# Altium project ImmPCB2.PRJPCB (part 1 of 2)
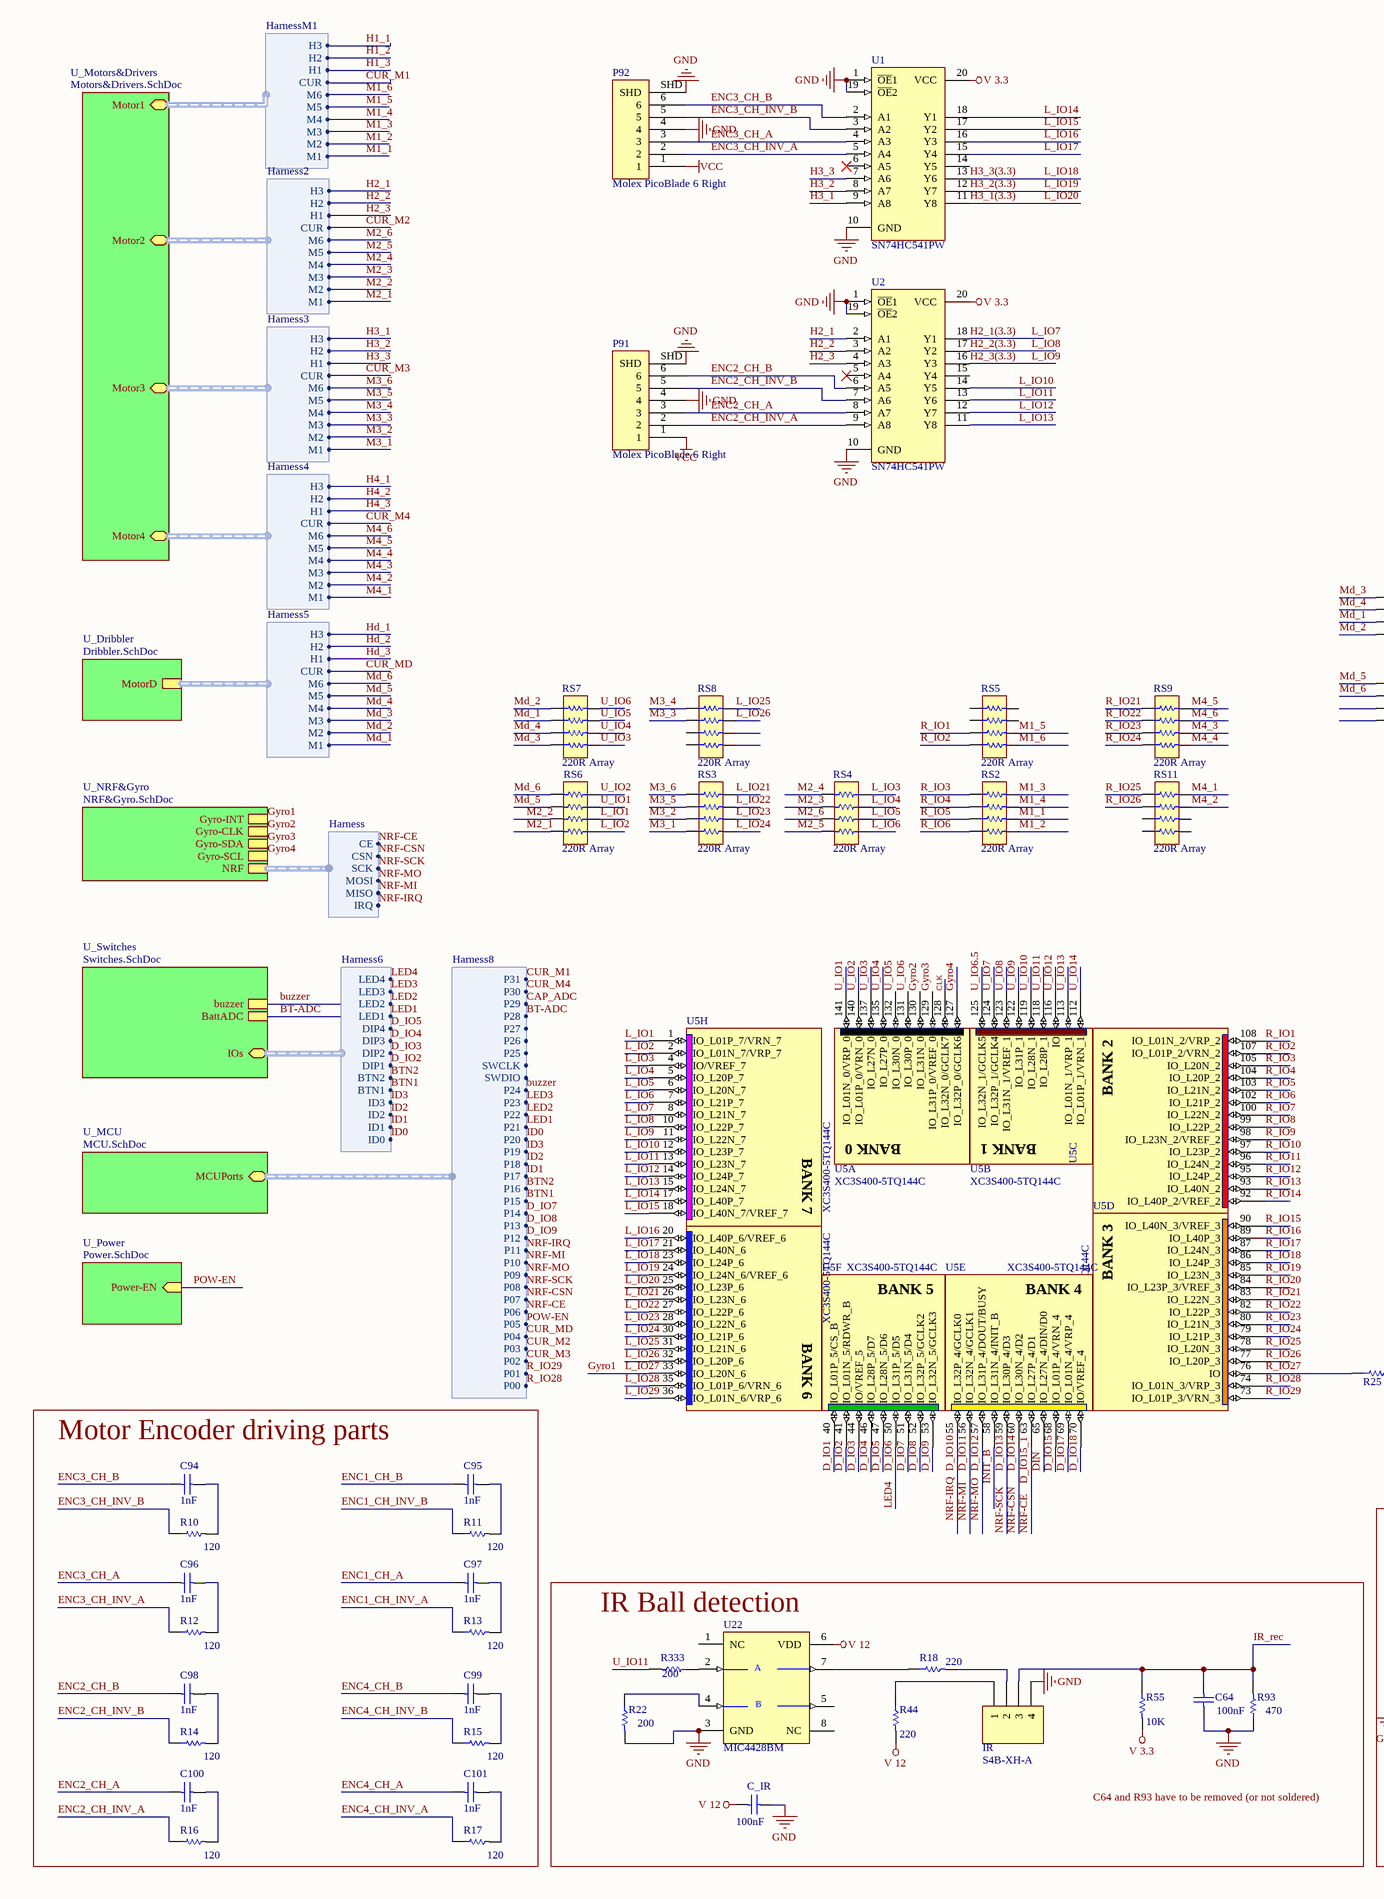
[diagram p0: FPGA.SchDoc, left]
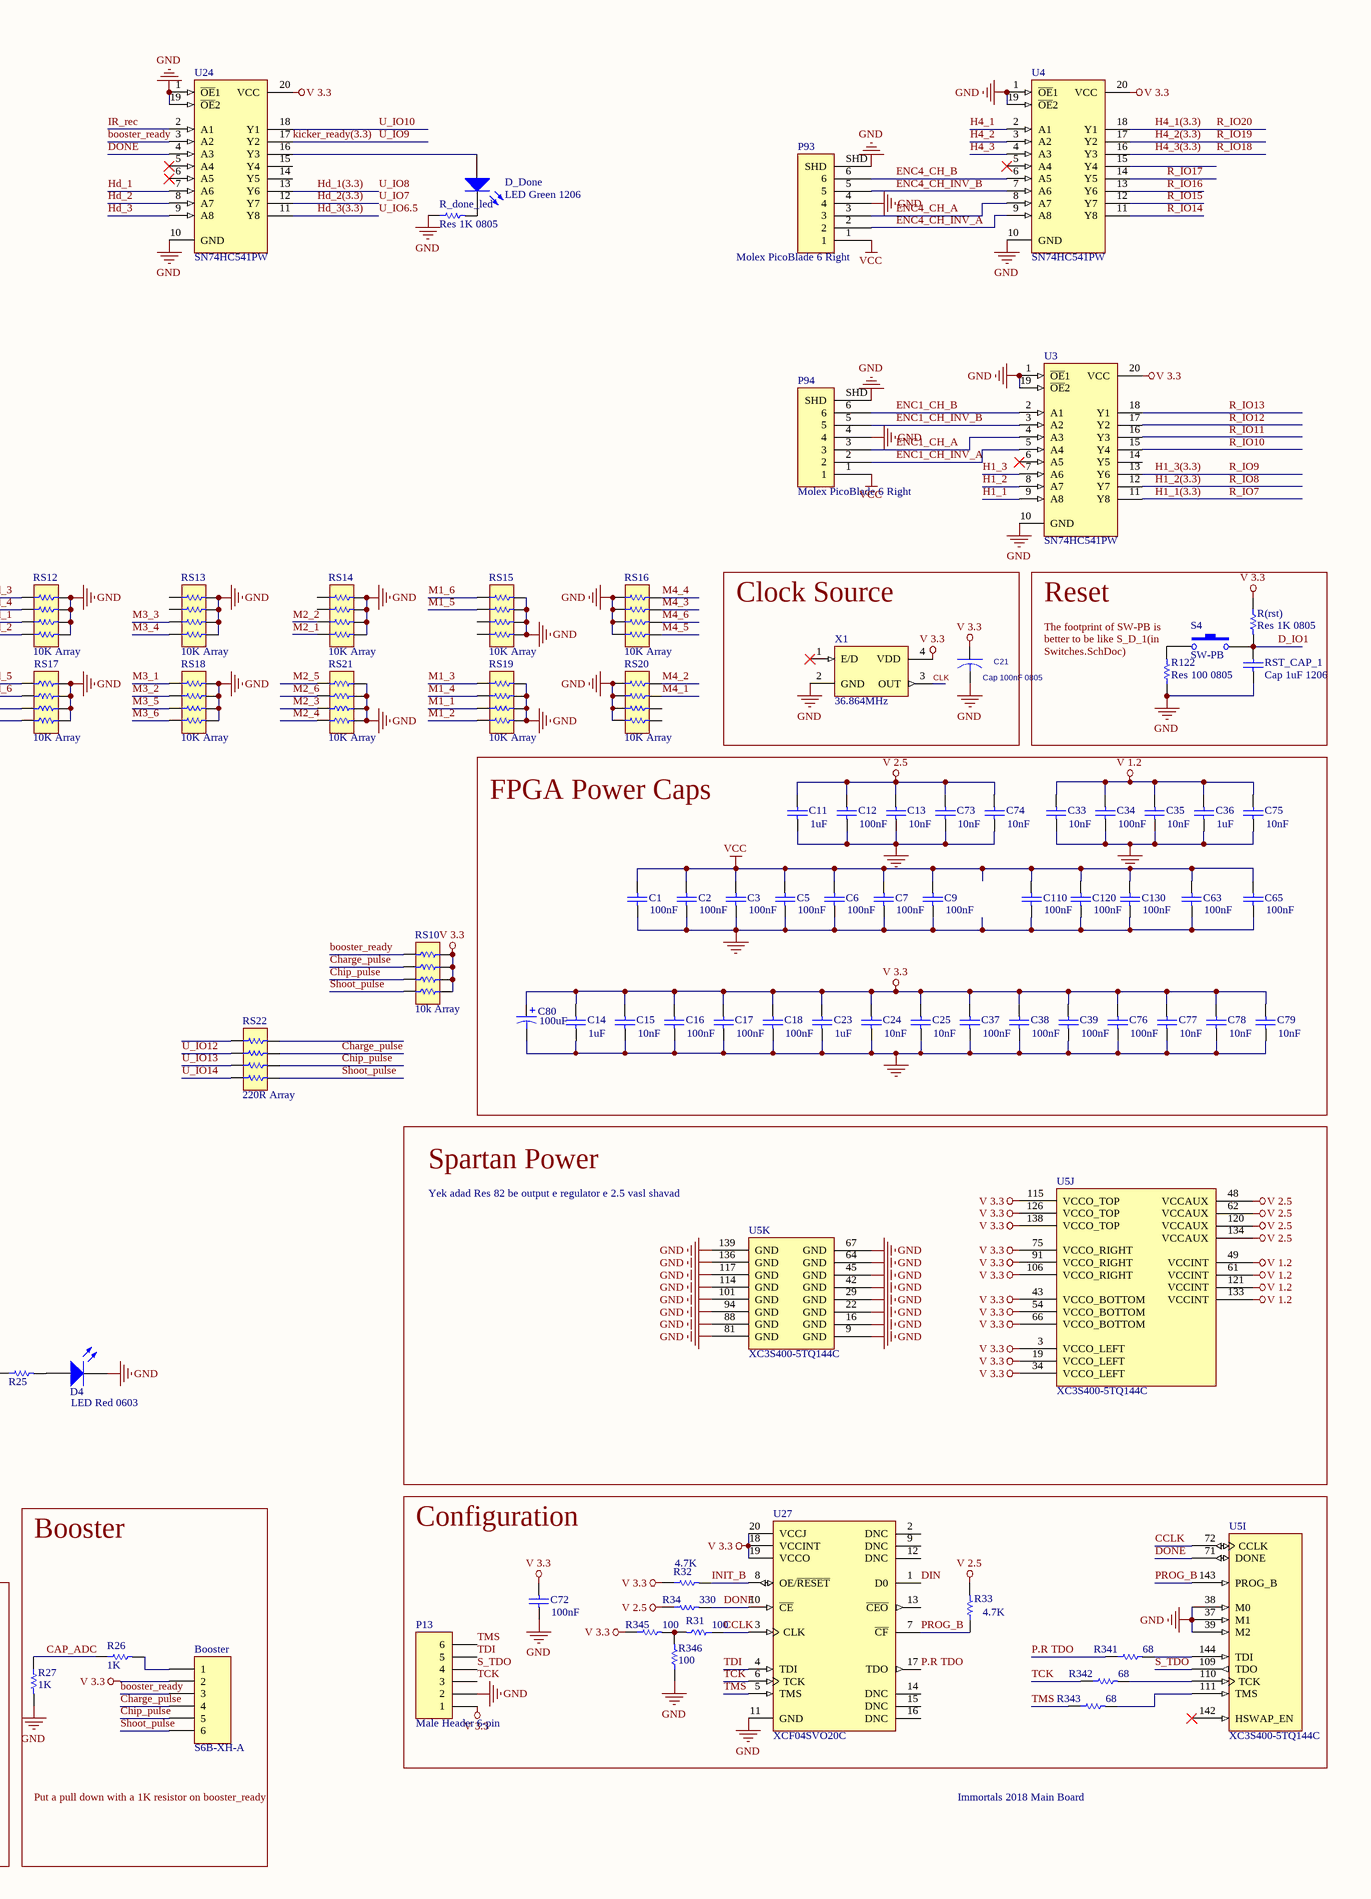
[diagram p1: FPGA.SchDoc, right]
7 sheets, 374 parts. Net scope: hierarchical (ports join the sheet entries above them; power ports are global).
Board file: ImmPCB2.PCBDOC
Sheets:
  FPGA.SchDoc
    U_Motors&Drivers = Motors&Drivers.SchDoc
    U_Dribbler = Dribbler.SchDoc
    U_Power = Power.SchDoc
    U_Switches = Switches.SchDoc
    U_NRF&Gyro = NRF&Gyro.SchDoc
    U_MCU = MCU.SchDoc

## Sheet FPGA.SchDoc
size A2

### Parts
Booster  S6B-XH-A  [S6B-XH-A]
C1  value 100nF  [C1206]  (hidden comment: Cap 100nF 1206)
C2  value 100nF  [C1206]  (hidden comment: Cap 100nF 1206)
C3  value 100nF  [C1206]  (hidden comment: Cap 100nF 1206)
C5  value 100nF  [C1206]  (hidden comment: Cap 100nF 1206)
C6  value 100nF  [C1206]  (hidden comment: Cap 100nF 1206)
C7  value 100nF  [C1206]  (hidden comment: Cap 100nF 1206)
C9  value 100nF  [C1206]  (hidden comment: Cap 100nF 1206)
C11  value 1uF  [1608[0603]]  (hidden comment: Cap 1uF 0603)
C12  value 100nF  [1608[0603]]  (hidden comment: Cap 100nF 0603)
C13  value 10nF  [1608[0603]]  (hidden comment: Cap 10nF 0603)
C14  value 1uF  [1608[0603]]  (hidden comment: Cap 1uF 0603)
C15  value 10nF  [1608[0603]]  (hidden comment: Cap 10nF 0603)
C16  value 100nF  [1608[0603]]  (hidden comment: Cap 100nF 0603)
C17  value 100nF  [1608[0603]]  (hidden comment: Cap 100nF 0603)
C18  value 100nF  [1608[0603]]  (hidden comment: Cap 100nF 0603)
C21  Cap 100nF 0805  [2012[0805]]
C23  value 1uF  [1608[0603]]  (hidden comment: Cap 1uF 0603)
C24  value 10nF  [1608[0603]]  (hidden comment: Cap 10nF 0603)
C25  value 10nF  [1608[0603]]  (hidden comment: Cap 10nF 0603)
C33  value 10nF  [1608[0603]]  (hidden comment: Cap 10nF 0603)
C34  value 100nF  [1608[0603]]  (hidden comment: Cap 100nF 0603)
C35  value 10nF  [1608[0603]]  (hidden comment: Cap 10nF 0603)
C36  value 1uF  [1608[0603]]  (hidden comment: Cap 1uF 0603)
C37  value 100nF  [1608[0603]]  (hidden comment: Cap 100nF 0603)
C38  value 100nF  [1608[0603]]  (hidden comment: Cap 100nF 0603)
C39  value 100nF  [1608[0603]]  (hidden comment: Cap 100nF 0603)
C63  value 100nF  [C0805]  (hidden comment: Cap 100nF 0805)
C64  value 100nF  [1608[0603]]  (hidden comment: Cap 100nF 0603)
C65  value 100nF  [C0805]  (hidden comment: Cap 100nF 0805)
C72  value 100nF  [C0805]  (hidden comment: Cap 100nF 0805)
C73  value 10nF  [1608[0603]]  (hidden comment: Cap 10nF 0603)
C74  value 10nF  [1608[0603]]  (hidden comment: Cap 10nF 0603)
C75  value 10nF  [1608[0603]]  (hidden comment: Cap 10nF 0603)
C76  value 100nF  [1608[0603]]  (hidden comment: Cap 100nF 0603)
C77  value 10nF  [1608[0603]]  (hidden comment: Cap 10nF 0603)
C78  value 10nF  [1608[0603]]  (hidden comment: Cap 10nF 0603)
C79  value 10nF  [1608[0603]]  (hidden comment: Cap 10nF 0603)
C80  value 100uF  [6332[2512]]  (hidden comment: Cap 100uF 2512)
C94  value 1nF  [1608[0603]]  (hidden comment: Cap 1nF 0603)
C95  value 1nF  [1608[0603]]  (hidden comment: Cap 1nF 0603)
C96  value 1nF  [1608[0603]]  (hidden comment: Cap 1nF 0603)
C97  value 1nF  [1608[0603]]  (hidden comment: Cap 1nF 0603)
C98  value 1nF  [1608[0603]]  (hidden comment: Cap 1nF 0603)
C99  value 1nF  [1608[0603]]  (hidden comment: Cap 1nF 0603)
C100  value 1nF  [1608[0603]]  (hidden comment: Cap 1nF 0603)
C101  value 1nF  [1608[0603]]  (hidden comment: Cap 1nF 0603)
C110  value 100nF  [C1206]  (hidden comment: Cap 100nF 1206)
C120  value 100nF  [C1206]  (hidden comment: Cap 100nF 1206)
C130  value 100nF  [C1206]  (hidden comment: Cap 100nF 1206)
C_IR  value 100nF  [C0805]  (hidden comment: Cap 100nF 0805)
D4  LED Red 0603  [LED 0603]
D_Done  LED Green 1206  [3.2X1.6X1.1 - GREEN]
IR  S4B-XH-A  [S4B-XH-A]
P13  Male Header 6-pin  [HDR1X6]
P91  Molex PicoBlade 6 Right  [Molex PicoBlade 6 Right SMD]
P92  Molex PicoBlade 6 Right  [Molex PicoBlade 6 Right SMD]
P93  Molex PicoBlade 6 Right  [Molex PicoBlade 6 Right SMD]
P94  Molex PicoBlade 6 Right  [Molex PicoBlade 6 Right SMD]
R10  value 120  [1608[0603]]  (hidden comment: Res 120 0603)
R11  value 120  [1608[0603]]  (hidden comment: Res 120 0603)
R12  value 120  [1608[0603]]  (hidden comment: Res 120 0603)
R13  value 120  [1608[0603]]  (hidden comment: Res 120 0603)
R14  value 120  [1608[0603]]  (hidden comment: Res 120 0603)
R15  value 120  [1608[0603]]  (hidden comment: Res 120 0603)
R16  value 120  [1608[0603]]  (hidden comment: Res 120 0603)
R17  value 120  [1608[0603]]  (hidden comment: Res 120 0603)
R18  value 220  [2012[0805]]  (hidden comment: Res 220 0805)
R22  value 200  [2012[0805]]  (hidden comment: Res 200 0805)
R25  Res 330 0603  [R0603]  (value not drawn)
R26  value 1K  [2012[0805]]  (hidden comment: Res 1K 0805)
R27  value 1K  [2012[0805]]  (hidden comment: Res 1K 0805)
R31  value 100  [2012[0805]]  (hidden comment: Res 100 0805)
R32  value 4.7K  [2012[0805]]  (hidden comment: Res 4.7K 0805)
R33  value 4.7K  [2012[0805]]  (hidden comment: Res 4.7K 0805)
R34  value 330  [2012[0805]]  (hidden comment: Res 330 0805)
R44  value 220  [2012[0805]]  (hidden comment: Res 220 0805)
R55  value 10K  [2012[0805]]  (hidden comment: Res 10K 0805)
R93  value 470  [1608[0603]]  (hidden comment: Res 470 0603)
R122  Res 100 0805  [2012[0805]]
R333  value 200  [2012[0805]]  (hidden comment: Res 200 0805)
R341  value 68  [2012[0805]]  (hidden comment: Res 68 0805)
R342  value 68  [2012[0805]]  (hidden comment: Res 68 0805)
R343  value 68  [2012[0805]]  (hidden comment: Res 68 0805)
R345  value 100  [2012[0805]]  (hidden comment: Res 100 0805)
R346  value 100  [2012[0805]]  (hidden comment: Res 100 0805)
R(rst)  Res 1K 0805  [2012[0805]]
R_done_led  Res 1K 0805  [2012[0805]]
RS2  220R Array  [RES-4B]
RS3  220R Array  [RES-4B]
RS4  220R Array  [RES-4B]
RS5  220R Array  [RES-4B]
RS6  220R Array  [RES-4B]
RS7  220R Array  [RES-4B]
RS8  220R Array  [RES-4B]
RS9  220R Array  [RES-4B]
RS10  10k Array  [RES-4B]
RS11  220R Array  [RES-4B]
RS12  10K Array  [RES-4B]
RS13  10K Array  [RES-4B]
RS14  10K Array  [RES-4B]
RS15  10K Array  [RES-4B]
RS16  10K Array  [RES-4B]
RS17  10K Array  [RES-4B]
RS18  10K Array  [RES-4B]
RS19  10K Array  [RES-4B]
RS20  10K Array  [RES-4B]
RS21  10K Array  [RES-4B]
RS22  220R Array  [RES-4B]
RST_CAP_1  Cap 1uF 1206  [3216[1206]]
S4  SW-PB  [SPST-2]
U1  SN74HC541PW  [PW020_N]
U2  SN74HC541PW  [PW020_N]
U3  SN74HC541PW  [PW020_N]
U4  SN74HC541PW  [PW020_N]
U5  XC3S400-5TQ144C  [TQ144_L]  (parts A,B,C,D,E,F,G,H,I,J,K of 11)
U22  MIC4428BM  [NSO8_L]
U24  SN74HC541PW  [PW020_N]
U27  XCF04SVO20C  [VO20_N]
X1  36.864MHz  [QSMO_4200]

### Blocks framed on the sheet
Clock Source: C21 X1
Reset: R122 R(rst) RST_CAP_1 S4
FPGA Power Caps: C1-C3 C5-C7 C9 C11-C18 C23-C25 C33-C39 C63 C65 C73-C80 C110 C120 C130
Spartan Power: U5
Motor Encoder driving parts: C94-C101 R10-R17
Booster: Booster R26 R27
Configuration: C72 P13 R31-R34 R341-R343 R345 R346 U5 U27
IR Ball detection: C64 C_IR IR R18 R22 R44 R55 R93 R333 U22

### Sub-sheets
U_Dribbler = Dribbler.SchDoc: MotorD (harness Harness5)
U_MCU = MCU.SchDoc: MCUPorts (harness Harness8)
U_Motors&Drivers = Motors&Drivers.SchDoc: Motor1 (harness HarnessM1), Motor2 (harness Harness2), Motor4 (harness Harness4), Motor3 (harness Harness3)
U_NRF&Gyro = NRF&Gyro.SchDoc: NRF (harness Harness), Gyro-SCL, Gyro-SDA, Gyro-CLK, Gyro-INT
U_Power = Power.SchDoc: Power-EN (in)
U_Switches = Switches.SchDoc: BattADC, buzzer, IOs (harness Harness6)

### Harnesses
HarnessM1: M1, M2, M3, M4, M5, M6, CUR, H1, H2, H3
Harness2: M1, M2, M3, M4, M5, M6, CUR, H1, H2, H3
Harness3: M1, M2, M3, M4, M5, M6, CUR, H1, H2, H3
Harness4: M1, M2, M3, M4, M5, M6, CUR, H1, H2, H3
Harness5: M1, M2, M3, M4, M5, M6, CUR, H1, H2, H3
Harness6: ID0, ID1, ID2, ID3, BTN1, BTN2, DIP1, DIP2, DIP3, DIP4, LED1, LED2, LED3, LED4
Harness: IRQ, MISO, MOSI, SCK, CSN, CE
Harness8: P00, P01, P02, P03, P04, P05, P06, P07, P08, P09, P10, P11, P12, P13, P14, P15, P16, P17, P18, P19, P20, P21, P22, P23, P24, SWDIO, SWCLK, P25, P26, P27, P28, P29, P30, P31

### Nets
GND: C1.2 C2.2 C3.2 C5.2 C6.2 C7.2 C9.2 C11.1 C12.1 C13.1 C14.1 C15.1 C16.1 C17.1 C18.1 C21.2 C23.1 C24.1 C25.1 C33.1 C34.1 C35.1 C36.1 C37.1 C38.1 C39.1 C63.2 C64.1 C65.2 C72.2 C73.1 C74.1 C75.1 C76.1 C77.1 C78.1 C79.1 C80.2 C110.2 C120.2 C130.2 C_IR.2 D4.2(K) IR.4 P13.2 P91.4 P91.SHD P92.4 P92.SHD P93.4 P93.SHD P94.4 P94.SHD R22.2 R27.2 R93.1 R122.1 R346.1 R_done_led.1 RS12.2 RS12.4 RS12.6 RS12.8 RS13.2 RS13.4 RS13.6 RS13.8 RS14.2 RS14.4 RS14.6 RS14.8 RS15.2 RS15.4 RS15.6 RS15.8 RS16.1 RS16.3 RS16.5 RS16.7 RS17.1 RS17.3 RS17.5 RS17.7 RS18.2 RS18.4 RS18.6 RS18.8 RS19.2 RS19.4 RS19.6 RS19.8 RS20.1 RS20.3 RS20.5 RS20.7 RS21.1 RS21.3 RS21.5 RS21.7 RST_CAP_1.1 U1.1(~{OE}1) U1.10(GND) U1.19(~{OE}2) U2.1(~{OE}1) U2.10(GND) U2.19(~{OE}2) U3.1(~{OE}1) U3.10(GND) U3.19(~{OE}2) U4.1(~{OE}1) U4.10(GND) U4.19(~{OE}2) U5.9(GND) U5.16(GND) U5.22(GND) U5.29(GND) U5.37(M1) U5.38(M0) U5.39(M2) U5.42(GND) U5.45(GND) U5.64(GND) U5.67(GND) U5.81(GND) U5.88(GND) U5.94(GND) U5.101(GND) U5.114(GND) U5.117(GND) U5.136(GND) U5.139(GND) U22.3(GND) U24.1(~{OE}1) U24.10(GND) U24.19(~{OE}2) U27.11(GND) X1.2(GND)
V 1.2: C33.2 C34.2 C35.2 C36.2 C75.2 U5.49(VCCINT) U5.61(VCCINT) U5.121(VCCINT) U5.133(VCCINT)
V 2.5: C11.2 C12.2 C13.2 C73.2 C74.2 R33.2 R34.1 U5.48(VCCAUX) U5.62(VCCAUX) U5.120(VCCAUX) U5.134(VCCAUX)
V 3.3: Booster.2 C14.2 C15.2 C16.2 C17.2 C18.2 C21.1 C23.2 C24.2 C25.2 C37.2 C38.2 C39.2 C72.1 C76.2 C77.2 C78.2 C79.2 C80.1 P13.1 R32.1 R55.2 R345.1 R(rst).1 RS10.1 RS10.3 RS10.5 RS10.7 U1.20(VCC) U2.20(VCC) U3.20(VCC) U4.20(VCC) U5.3(VCCO_LEFT) U5.19(VCCO_LEFT) U5.34(VCCO_LEFT) U5.43(VCCO_BOTTOM) U5.54(VCCO_BOTTOM) U5.66(VCCO_BOTTOM) U5.75(VCCO_RIGHT) U5.91(VCCO_RIGHT) U5.106(VCCO_RIGHT) U5.115(VCCO_TOP) U5.126(VCCO_TOP) U5.138(VCCO_TOP) U24.20(VCC) U27.18(VCCINT) U27.19(VCCO) U27.20(VCCJ) X1.4(VDD)
V 12: C_IR.1 R44.2 U22.6(VDD)
VCC: C1.1 C2.1 C3.1 C5.1 C6.1 C7.1 C9.1 C63.1 C65.1 C110.1 C120.1 C130.1 P91.1 P92.1 P93.1 P94.1
booster_ready: Booster.3 RS10.8 U24.3(A2)
BT-ADC: sheet U_Switches/BattADC, sheet U_MCU/MCUPorts.P28
BTN1: sheet U_Switches/IOs.BTN1, sheet U_MCU/MCUPorts.P15
BTN2: sheet U_Switches/IOs.BTN2, sheet U_MCU/MCUPorts.P16
buzzer: sheet U_Switches/buzzer, sheet U_MCU/MCUPorts.P24
CAP_ADC: R26.1 R27.1 ; sheet U_MCU/MCUPorts.P29
CCLK: R31.1 U5.72(CCLK) U27.3(CLK)
Charge_pulse: Booster.4 RS10.6 RS22.4
Chip_pulse: Booster.5 RS10.4 RS22.6
CLK: U5.128(IO_L32N_0/GCLK7) X1.3(OUT)
CUR_M1: sheet U_Motors&Drivers/Motor1.CUR, sheet U_MCU/MCUPorts.P31
CUR_M2: sheet U_Motors&Drivers/Motor2.CUR, sheet U_MCU/MCUPorts.P03
CUR_M3: sheet U_Motors&Drivers/Motor3.CUR, sheet U_MCU/MCUPorts.P02
CUR_M4: sheet U_Motors&Drivers/Motor4.CUR, sheet U_MCU/MCUPorts.P30
CUR_MD: sheet U_Dribbler/MotorD.CUR, sheet U_MCU/MCUPorts.P04
D_IO1: R(rst).2 RST_CAP_1.2 S4.2 U5.40(IO_L01P_5/CS_B)
D_IO2: U5.41(IO_L01N_5/RDWR_B) ; sheet U_Switches/IOs.DIP1
D_IO3: U5.44(IO/VREF_5) ; sheet U_Switches/IOs.DIP2
D_IO4: U5.46(IO_L28P_5/D7) ; sheet U_Switches/IOs.DIP3
D_IO5: U5.47(IO_L28N_5/D6) ; sheet U_Switches/IOs.DIP4
D_IO6: U5.50(IO_L31P_5/D5) ; sheet U_Switches/IOs.LED4  [also labelled LED4]
D_IO7: U5.51(IO_L31N_5/D4) ; sheet U_MCU/MCUPorts.P14
D_IO8: U5.52(IO_L32P_5/GCLK2) ; sheet U_MCU/MCUPorts.P13
D_IO9: U5.53(IO_L32N_5/GCLK3) ; sheet U_MCU/MCUPorts.P12
D_IO10: U5.55(IO_L32P_4/GCLK0) ; sheet U_NRF&Gyro/NRF.IRQ, sheet U_MCU/MCUPorts.P11  [also labelled NRF-IRQ]
D_IO11: U5.56(IO_L32N_4/GCLK1) ; sheet U_NRF&Gyro/NRF.MISO, sheet U_MCU/MCUPorts.P10  [also labelled NRF-MI]
D_IO12: U5.57(IO_L31P_4/DOUT/BUSY) ; sheet U_NRF&Gyro/NRF.MOSI, sheet U_MCU/MCUPorts.P09  [also labelled NRF-MO]
D_IO13: U5.59(IO_L30P_4/D3) ; sheet U_NRF&Gyro/NRF.SCK, sheet U_MCU/MCUPorts.P08  [also labelled NRF-SCK]
D_IO14: U5.60(IO_L30N_4/D2) ; sheet U_NRF&Gyro/NRF.CSN, sheet U_MCU/MCUPorts.P07  [also labelled NRF-CSN]
D_IO15: U5.68(IO_L01P_4/VRN_4)
D_IO15_1: U5.63(IO_L27P_4/D1) ; sheet U_NRF&Gyro/NRF.CE, sheet U_MCU/MCUPorts.P06  [also labelled NRF-CE]
D_IO17: U5.69(IO_L01N_4/VRP_4)
D_IO18: U5.70(IO/VREF_4)
DIN: U5.65(IO_L27N_4/DIN/D0) U27.1(D0)
DONE: R34.2 U5.71(DONE) U24.4(A3) U27.10(~{CE})
ENC1_CH_A: C97.2 P94.3 U3.4(A3)
ENC1_CH_B: C95.2 P94.6 U3.2(A1)
ENC1_CH_INV_A: P94.2 R13.1 U3.5(A4)
ENC1_CH_INV_B: P94.5 R11.1 U3.3(A2)
ENC2_CH_A: C100.2 P91.3 U2.8(A7)
ENC2_CH_B: C98.2 P91.6 U2.6(A5)
ENC2_CH_INV_A: P91.2 R16.1 U2.9(A8)
ENC2_CH_INV_B: P91.5 R14.1 U2.7(A6)
ENC3_CH_A: C96.2 P92.3 U1.4(A3)
ENC3_CH_B: C94.2 P92.6 U1.2(A1)
ENC3_CH_INV_A: P92.2 R12.1 U1.5(A4)
ENC3_CH_INV_B: P92.5 R10.1 U1.3(A2)
ENC4_CH_A: C101.2 P93.3 U4.8(A7)
ENC4_CH_B: C99.2 P93.6 U4.6(A5)
ENC4_CH_INV_A: P93.2 R17.1 U4.9(A8)
ENC4_CH_INV_B: P93.5 R15.1 U4.7(A6)
Gyro1: U5.33(IO_L20N_6) ; sheet U_NRF&Gyro/Gyro-INT  [also labelled L_IO27]
Gyro2: U5.130(IO_L31N_0) ; sheet U_NRF&Gyro/Gyro-CLK
Gyro3: U5.129(IO_L31P_0/VREF_0) ; sheet U_NRF&Gyro/Gyro-SDA
Gyro4: U5.127(IO_L32P_0/GCLK6) ; sheet U_NRF&Gyro/Gyro-SCL
H1_1: U3.9(A8) ; sheet U_Motors&Drivers/Motor1.H3
H1_1(3.3): U3.11(Y8) U5.100(IO_L22N_2)  [also labelled R_IO7]
H1_2: U3.8(A7) ; sheet U_Motors&Drivers/Motor1.H2
H1_2(3.3): U3.12(Y7) U5.99(IO_L22P_2)  [also labelled R_IO8]
H1_3: U3.7(A6) ; sheet U_Motors&Drivers/Motor1.H1
H1_3(3.3): U3.13(Y6) U5.98(IO_L23N_2/VREF_2)  [also labelled R_IO9]
H2_1: U2.2(A1) ; sheet U_Motors&Drivers/Motor2.H3
H2_1(3.3): U2.18(Y1) U5.8(IO_L21N_7)  [also labelled L_IO7]
H2_2: U2.3(A2) ; sheet U_Motors&Drivers/Motor2.H2
H2_2(3.3): U2.17(Y2) U5.10(IO_L22P_7)  [also labelled L_IO8]
H2_3: U2.4(A3) ; sheet U_Motors&Drivers/Motor2.H1
H2_3(3.3): U2.16(Y3) U5.11(IO_L22N_7)  [also labelled L_IO9]
H3_1: U1.9(A8) ; sheet U_Motors&Drivers/Motor3.H3
H3_1(3.3): U1.11(Y8) U5.25(IO_L23P_6)  [also labelled L_IO20]
H3_2: U1.8(A7) ; sheet U_Motors&Drivers/Motor3.H2
H3_2(3.3): U1.12(Y7) U5.24(IO_L24N_6/VREF_6)  [also labelled L_IO19]
H3_3: U1.7(A6) ; sheet U_Motors&Drivers/Motor3.H1
H3_3(3.3): U1.13(Y6) U5.23(IO_L24P_6)  [also labelled L_IO18]
H4_1: U4.2(A1) ; sheet U_Motors&Drivers/Motor4.H3
H4_1(3.3): U4.18(Y1) U5.84(IO_L23P_3/VREF_3)  [also labelled R_IO20]
H4_2: U4.3(A2) ; sheet U_Motors&Drivers/Motor4.H2
H4_2(3.3): U4.17(Y2) U5.85(IO_L23N_3)  [also labelled R_IO19]
H4_3: U4.4(A3) ; sheet U_Motors&Drivers/Motor4.H1
H4_3(3.3): U4.16(Y3) U5.86(IO_L24P_3)  [also labelled R_IO18]
Hd_1: U24.7(A6) ; sheet U_Dribbler/MotorD.H3
Hd_1(3.3): U5.123(IO_L31N_1/VREF_1) U24.13(Y6)  [also labelled U_IO8]
Hd_2: U24.8(A7) ; sheet U_Dribbler/MotorD.H2
Hd_2(3.3): U5.124(IO_L32P_1/GCLK4) U24.12(Y7)  [also labelled U_IO7]
Hd_3: U24.9(A8) ; sheet U_Dribbler/MotorD.H1
Hd_3(3.3): U5.125(IO_L32N_1/GCLK5) U24.11(Y8)  [also labelled U_IO6.5]
ID0: sheet U_Switches/IOs.ID0, sheet U_MCU/MCUPorts.P20
ID1: sheet U_Switches/IOs.ID1, sheet U_MCU/MCUPorts.P17
ID2: sheet U_Switches/IOs.ID2, sheet U_MCU/MCUPorts.P18
ID3: sheet U_Switches/IOs.ID3, sheet U_MCU/MCUPorts.P19
INIT_B: R32.2 U5.58(IO_L31N_4/INIT_B) U27.8(OE/~{RESET})
IR_rec: C64.2 IR.3 R55.1 R93.2 U24.2(A1)
kicker_ready(3.3): U5.122(IO_L31P_1) U24.17(Y2)  [also labelled U_IO9]
L_IO1: RS6.3 U5.1(IO_L01P_7/VRN_7)
L_IO2: RS6.1 U5.2(IO_L01N_7/VRP_7)
L_IO3: RS4.7 U5.4(IO/VREF_7)
L_IO4: RS4.5 U5.5(IO_L20P_7)
L_IO5: RS4.3 U5.6(IO_L20N_7)
L_IO6: RS4.1 U5.7(IO_L21P_7)
L_IO10: U2.14(Y5) U5.12(IO_L23P_7)
L_IO11: U2.13(Y6) U5.13(IO_L23N_7)
L_IO12: U2.12(Y7) U5.14(IO_L24P_7)
L_IO13: U2.11(Y8) U5.15(IO_L24N_7)
L_IO14: U1.18(Y1) U5.17(IO_L40P_7)
L_IO15: U1.17(Y2) U5.18(IO_L40N_7/VREF_7)
L_IO16: U1.16(Y3) U5.20(IO_L40P_6/VREF_6)
L_IO17: U1.15(Y4) U5.21(IO_L40N_6)
L_IO21: RS3.2 U5.26(IO_L23N_6)
L_IO22: RS3.4 U5.27(IO_L22P_6)
L_IO23: RS3.6 U5.28(IO_L22N_6)
L_IO24: RS3.8 U5.30(IO_L21P_6)
L_IO25: RS8.2 U5.31(IO_L21N_6)
L_IO26: RS8.4 U5.32(IO_L20P_6)
L_IO28: U5.35(IO_L01P_6/VRN_6)
L_IO29: U5.36(IO_L01N_6/VRP_6)
LED1: sheet U_Switches/IOs.LED1, sheet U_MCU/MCUPorts.P21
LED2: sheet U_Switches/IOs.LED2, sheet U_MCU/MCUPorts.P22
LED3: sheet U_Switches/IOs.LED3, sheet U_MCU/MCUPorts.P23
M1_1: RS2.6 RS19.5 ; sheet U_Motors&Drivers/Motor1.M1
M1_2: RS2.8 RS19.7 ; sheet U_Motors&Drivers/Motor1.M2
M1_3: RS2.2 RS19.1 ; sheet U_Motors&Drivers/Motor1.M3
M1_4: RS2.4 RS19.3 ; sheet U_Motors&Drivers/Motor1.M4
M1_5: RS5.6 RS15.3 ; sheet U_Motors&Drivers/Motor1.M5
M1_6: RS5.8 RS15.1 ; sheet U_Motors&Drivers/Motor1.M6
M2_1: RS6.2 RS14.7 ; sheet U_Motors&Drivers/Motor2.M1
M2_2: RS6.4 RS14.5 ; sheet U_Motors&Drivers/Motor2.M2
M2_3: RS4.6 RS21.4 ; sheet U_Motors&Drivers/Motor2.M3
M2_4: RS4.8 RS21.2 ; sheet U_Motors&Drivers/Motor2.M4
M2_5: RS4.2 RS21.8 ; sheet U_Motors&Drivers/Motor2.M5
M2_6: RS4.4 RS21.6 ; sheet U_Motors&Drivers/Motor2.M6
M3_1: RS3.7 RS18.1 ; sheet U_Motors&Drivers/Motor3.M1
M3_2: RS3.5 RS18.3 ; sheet U_Motors&Drivers/Motor3.M2
M3_3: RS8.3 RS13.5 ; sheet U_Motors&Drivers/Motor3.M3
M3_4: RS8.1 RS13.7 ; sheet U_Motors&Drivers/Motor3.M4
M3_5: RS3.3 RS18.5 ; sheet U_Motors&Drivers/Motor3.M5
M3_6: RS3.1 RS18.7 ; sheet U_Motors&Drivers/Motor3.M6
M4_1: RS11.2 RS20.4 ; sheet U_Motors&Drivers/Motor4.M1
M4_2: RS11.4 RS20.2 ; sheet U_Motors&Drivers/Motor4.M2
M4_3: RS9.6 RS16.4 ; sheet U_Motors&Drivers/Motor4.M3
M4_4: RS9.8 RS16.2 ; sheet U_Motors&Drivers/Motor4.M4
M4_5: RS9.2 RS16.8 ; sheet U_Motors&Drivers/Motor4.M5
M4_6: RS9.4 RS16.6 ; sheet U_Motors&Drivers/Motor4.M6
Md_1: RS7.3 RS12.5 ; sheet U_Dribbler/MotorD.M1
Md_2: RS7.1 RS12.7 ; sheet U_Dribbler/MotorD.M2
Md_3: RS7.7 RS12.1 ; sheet U_Dribbler/MotorD.M3
Md_4: RS7.5 RS12.3 ; sheet U_Dribbler/MotorD.M4
Md_5: RS6.6 RS17.8 ; sheet U_Dribbler/MotorD.M5
Md_6: RS6.8 RS17.6 ; sheet U_Dribbler/MotorD.M6
P.R TDO: R341.1 U27.17(TDO)
POW-EN: sheet U_Power/Power-EN, sheet U_MCU/MCUPorts.P05  [project net P0.05/AIN3]
PROG_B: R33.1 U5.143(PROG_B) U27.7(~{CF})
R_IO1: RS5.5 U5.108(IO_L01N_2/VRP_2)
R_IO2: RS5.7 U5.107(IO_L01P_2/VRN_2)
R_IO3: RS2.1 U5.105(IO_L20N_2)
R_IO4: RS2.3 U5.104(IO_L20P_2)
R_IO5: RS2.5 U5.103(IO_L21N_2)
R_IO6: RS2.7 U5.102(IO_L21P_2)
R_IO10: U3.15(Y4) U5.97(IO_L23P_2)
R_IO11: U3.16(Y3) U5.96(IO_L24N_2)
R_IO12: U3.17(Y2) U5.95(IO_L24P_2)
R_IO13: U3.18(Y1) U5.93(IO_L40N_2)
R_IO14: U4.11(Y8) U5.92(IO_L40P_2/VREF_2)
R_IO15: U4.12(Y7) U5.90(IO_L40N_3/VREF_3)
R_IO16: U4.13(Y6) U5.89(IO_L40P_3)
R_IO17: U4.14(Y5) U5.87(IO_L24N_3)
R_IO21: RS9.1 U5.83(IO_L22N_3)
R_IO22: RS9.3 U5.82(IO_L22P_3)
R_IO23: RS9.5 U5.80(IO_L21N_3)
R_IO24: RS9.7 U5.79(IO_L21P_3)
R_IO25: RS11.1 U5.78(IO_L20N_3)
R_IO26: RS11.3 U5.77(IO_L20P_3)
R_IO27: R25.1 U5.76(IO)
R_IO28: U5.74(IO_L01N_3/VRP_3) ; sheet U_MCU/MCUPorts.P00  [project net P0.00/XL1]
R_IO29: U5.73(IO_L01P_3/VRN_3) ; sheet U_MCU/MCUPorts.P01  [project net P0.01/XL2]
S_TDO: P13.4 U5.109(TDO)
Shoot_pulse: Booster.6 RS10.2 RS22.8
TCK: P13.3 R342.1 U27.6(TCK)
TDI: P13.5 U27.4(TDI)
TMS: P13.6 R343.1 U27.5(TMS)
U_IO1: RS6.5 U5.141(IO_L01N_0/VRP_0)
U_IO2: RS6.7 U5.140(IO_L01P_0/VRN_0)
U_IO3: RS7.8 U5.137(IO_L27N_0)
U_IO4: RS7.6 U5.135(IO_L27P_0)
U_IO5: RS7.4 U5.132(IO_L30N_0)
U_IO6: RS7.2 U5.131(IO_L30P_0)
U_IO10: U5.119(IO_L28N_1) U24.18(Y1)
U_IO11: R333.2 U5.118(IO_L28P_1)
U_IO12: RS22.3 U5.116(IO)
U_IO13: RS22.5 U5.113(IO_L01N_1/VRP_1)
U_IO14: RS22.7 U5.112(IO_L01P_1/VRN_1)
NetBooster_1: Booster.1 R26.2
NetC94_1: C94.1 R10.2
NetC95_1: C95.1 R11.2
NetC96_1: C96.1 R12.2
NetC97_1: C97.1 R13.2
NetC98_1: C98.1 R14.2
NetC99_1: C99.1 R15.2
NetC100_1: C100.1 R16.2
NetC101_1: C101.1 R17.2
NetD4_1: D4.1(A) R25.2
NetD_Done_1: D_Done.1(A) U24.16(Y3)
NetD_Done_2: D_Done.2(K) R_done_led.2
NetIR_1: IR.1 R44.1
NetIR_2: IR.2 R18.2
NetR18_1: R18.1 U22.7(OUTA)
NetR22_1: R22.1 U22.4(INB)
NetR31_2: R31.2 R345.2 R346.2
NetR122_2: R122.2 S4.1
NetR333_1: R333.1 U22.2(INA)
NetR341_2: R341.2 U5.144(TDI)
NetR342_2: R342.2 U5.110(TCK)
NetR343_2: R343.2 U5.111(TMS)

Not connected (* = marked no-connect by the designer): RS5 1 2 3 4; RS8 5 6 7 8; RS11 5 6 7 8; RS13 1 3; RS14 1 3; RS15 5 7; RS17 2 4; RS20 6 8; RS22 1 2; U1 6(A5)* 14(Y5); U2 5(A4)* 15(Y4); U3 6(A5)* 14(Y5); U4 5(A4)* 15(Y4); U5 142(HSWAP_EN)*; U22 1(NC) 5(OUTB) 8(NC); U24 5(A4)* 6(A5)* 14(Y5) 15(Y4); U27 2(DNC) 9(DNC) 12(DNC) 13(~{CEO}) 14(DNC) 15(DNC) 16(DNC); X1 1(E/D)*

### Notes on the sheet
- The footprint of SW-PB is
- (near S4) better to be like S_D_1(in
- (near R122) Switches.SchDoc)
- Yek adad Res 82 be output e regulator e 2.5 vasl shavad
- C64 and R93 have to be removed (or not soldered)
- Put a pull down with a 1K resistor on booster_ready
- Immortals 2018 Main Board
- (in symbol MAX4427CSA) A; B
- (in symbol XC3S400-5TQ144C, part A) BANK 0
- (in symbol XC3S400-5TQ144C, part B) BANK 1
- (in symbol XC3S400-5TQ144C, part C) BANK 2
- (in symbol XC3S400-5TQ144C, part D) BANK 3
- (in symbol XC3S400-5TQ144C, part E) BANK 4
- (in symbol XC3S400-5TQ144C, part F) BANK 5
- (in symbol XC3S400-5TQ144C, part G) BANK 6
- (in symbol XC3S400-5TQ144C, part H) BANK 7

### Library data of the parts
Booster P13 = Header 6: Header, 6-Pin; LatestRevisionDate: 17-Jul-2002; LatestRevisionNote: Re-released for DXP Platform.; Publisher: Altium Limited
C1-C3 C5-C7 C9 C63 C65 C72 C110 C120 C130 C_IR = CAP: Capacitor; Fitted: True
C11-C18 C23-C25 C33-C39 C64 C73-C79 C94-C101 = Cap Semi: Capacitor (Semiconductor SIM Model); Published: 8-Jun-2000; LatestRevisionDate: 17-Jul-2002; LatestRevisionNote: Re-released for DXP Platform.; PackageReference: C1206; Publisher: Altium Limited
C21 = C_Dup1: Value: Cap 100nF 0805
C80 = Cap Pol3: Polarized Capacitor (Surface Mount); Published: 8-Jun-2000; LatestRevisionDate: 17-Jul-2002; LatestRevisionNote: Re-released for DXP Platform.; PackageReference: C0805; Publisher: Altium Limited
D4 = LED 0603: LED ,SMD ,0603; Published: 8-Jun-2000; LatestRevisionDate: 17-Jul-2002; LatestRevisionNote: Re-released for DXP Platform.; PackageVersion: Feb-2002; PackageReference: 3.2X1.6X1.1; Publisher: Altium Limited; Value: LED Red 0603
D_Done = LED2: Typical RED, GREEN, YELLOW, AMBER GaAs LED; Published: 8-Jun-2000; LatestRevisionDate: 17-Jul-2002; LatestRevisionNote: Re-released for DXP Platform.; PackageDocument: Feb-2002; PackageReference: 3.2X1.6X1.1; Publisher: Altium Limited; Value: LED Green 1206
IR = Header 4: Header, 4-Pin; LatestRevisionDate: 17-Jul-2002; LatestRevisionNote: Re-released for DXP Platform.; Publisher: Altium Limited; Value: S4B-XH-A
R10-R18 R22 R26 R27 R31-R34 R44 R55 R93 R333 R341-R343 R345 R346 R_done_led = Res Semi: Semiconductor Resistor; Published: 8-Jun-2000; LatestRevisionDate: 17-Jul-2002; LatestRevisionNote: Re-released for DXP Platform.; PackageReference: AXIAL-0.5; Publisher: Altium Limited
  R_done_led: Value: 1K
R25 = R0603: Res 0603; Part Field 1: 3144; Value: 330
R122 R(rst) = Res1: Resistor; Published: 8-Jun-2000; LatestRevisionDate: 17-Jul-2002; LatestRevisionNote: Re-released for DXP Platform.; PackageReference: AXIAL-0.3; Publisher: Altium Limited
  R122: Value: Res 100 0805
  R(rst): Value: Res 1K 0805
RS2-RS22 = Resister Array: Resistor Array ,SMD
RST_CAP_1 = Cap: Capacitor; Published: 8-Jun-2000; LatestRevisionDate: 17-Jul-2002; LatestRevisionNote: Re-released for DXP Platform.; PackageReference: RAD-0.3; Publisher: Altium Limited; Value: Cap 1uF 1206
S4 = SW-PB: Switch; Value: Mini push button; Published: 24-Mar-1999; LatestRevisionDate: 17-Jul-2002; LatestRevisionNote: Re-released for DXP Platform.; PackageReference: SPST-2; Publisher: Altium Limited
U1-U4 U24 = SN74HC541PW: Octal Buffer/Driver with 3-State Outputs; Published: 8-Jun-2000; LatestRevisionDate: 13-Apr-2006; LatestRevisionNote: IPC-7351 Footprint Added.; DatasheetVersion: May-1997; PackageVersion: Mar-2000; PackageReference: DW020; Publisher: Altium Limited; PackageDescription: 20-Pin Plastic Small Outline Integrated Circuit 1.27 mm Pitch; Code_JEDEC: MS-013; Code_IPC: SOIC127P1030-20; ComponentLink1Description: Manufacturer Link; ComponentLink1URL: http://www.ti.com/; ComponentLink2Description: Datasheet; ComponentLink2URL: http://www-s.ti.com/sc/ds/sn74hc541.pdf
U5 = XC3S400-5TQ144C: Spartan-3 1.2V FPGA, 97 User I/Os, 144-Pin TQFP, High Performance, Commercial Grade; Ordering Information: Additional code may have to be appended for different mask revision devices.; Published: 17-Sep-2003; LatestRevisionDate: 13-Apr-2006; LatestRevisionNote: IPC-7351 Footprint Added.; DatasheetVersion: ver2.3, Nov-2007; PackageVersion: ver1.2, Jun-2004; PackageReference: TQ144; Publisher: Altium Limited; PackageDescription: 144-Pin Thin Quad Flat Pack (TQ144); Code_JEDEC: MS-026-BFB; ComponentLink1Description: Manufacturer Link; ComponentLink1URL: http://www.xilinx.com/products/silicon_solutions/fpgas/spartan_series/spartan3_fpgas/index.htm; ComponentLink2Description: Datasheet; ComponentLink2URL: http://direct.xilinx.com/bvdocs/publications/ds099.pdf
U22 = MAX4427CSA: Dual High-Speed 1.5A MOSFET Driver; Published: 16-Jan-2001; LatestRevisionDate: 13-Apr-2006; LatestRevisionNote: IPC-7351 Footprint Added.; DatasheetVersion: Mar-1993; PackageReference: NSO8; Publisher: Altium Limited; PackageDescription: 8-Pin Small Outline Integrated Circuit 1.27 mm Pitch; Code_JEDEC: MS-012-AA; Code_IPC: SOIC127P600-8; ComponentLink1Description: Manufacturer Link; ComponentLink1URL: http://www.maxim-ic.com/; ComponentLink2Description: Datasheet; ComponentLink2URL: http://pdfserv.maxim-ic.com/en/ds/MAX4426-MAX4428.pdf
U27 = XCF04SVO20C: XCF00S Series, Platform Flash In-System Programmable Configuration 3.3V PROM, 20-Pin TSOP, 4-Megabit, Commercial Grade; Published: 17-Sep-2003; LatestRevisionDate: 04-Mar-2005; LatestRevisionNote: Stylized 3D Model Added.; DatasheetVersion: ver2.9, May-2006; PackageVersion: ver1.2.1, Apr-2005; PackageReference: VO20; Publisher: Altium Limited; PackageDescription: 20-Pin Thin Shrink Small Outline Package (VO20); Code_JEDEC: MO-153-AC; ComponentLink1Description: Manufacturer Link; ComponentLink1URL: http://www.xilinx.com/products/design_resources/config_sol/index.htm; ComponentLink2Description: Datasheet; ComponentLink2URL: http://direct.xilinx.com/bvdocs/publications/ds123.pdf
X1 = QSMO_4200: QSMO - 4200 SERIES, 40MHz, SURFACE MOUNT CRYSTAL OSCILLATOR; Published: 5-Jan-2004; DatasheetDocument: 15-Jul-02; Publisher: Altium Limited

## Sheet Motors&Drivers.SchDoc
size A3
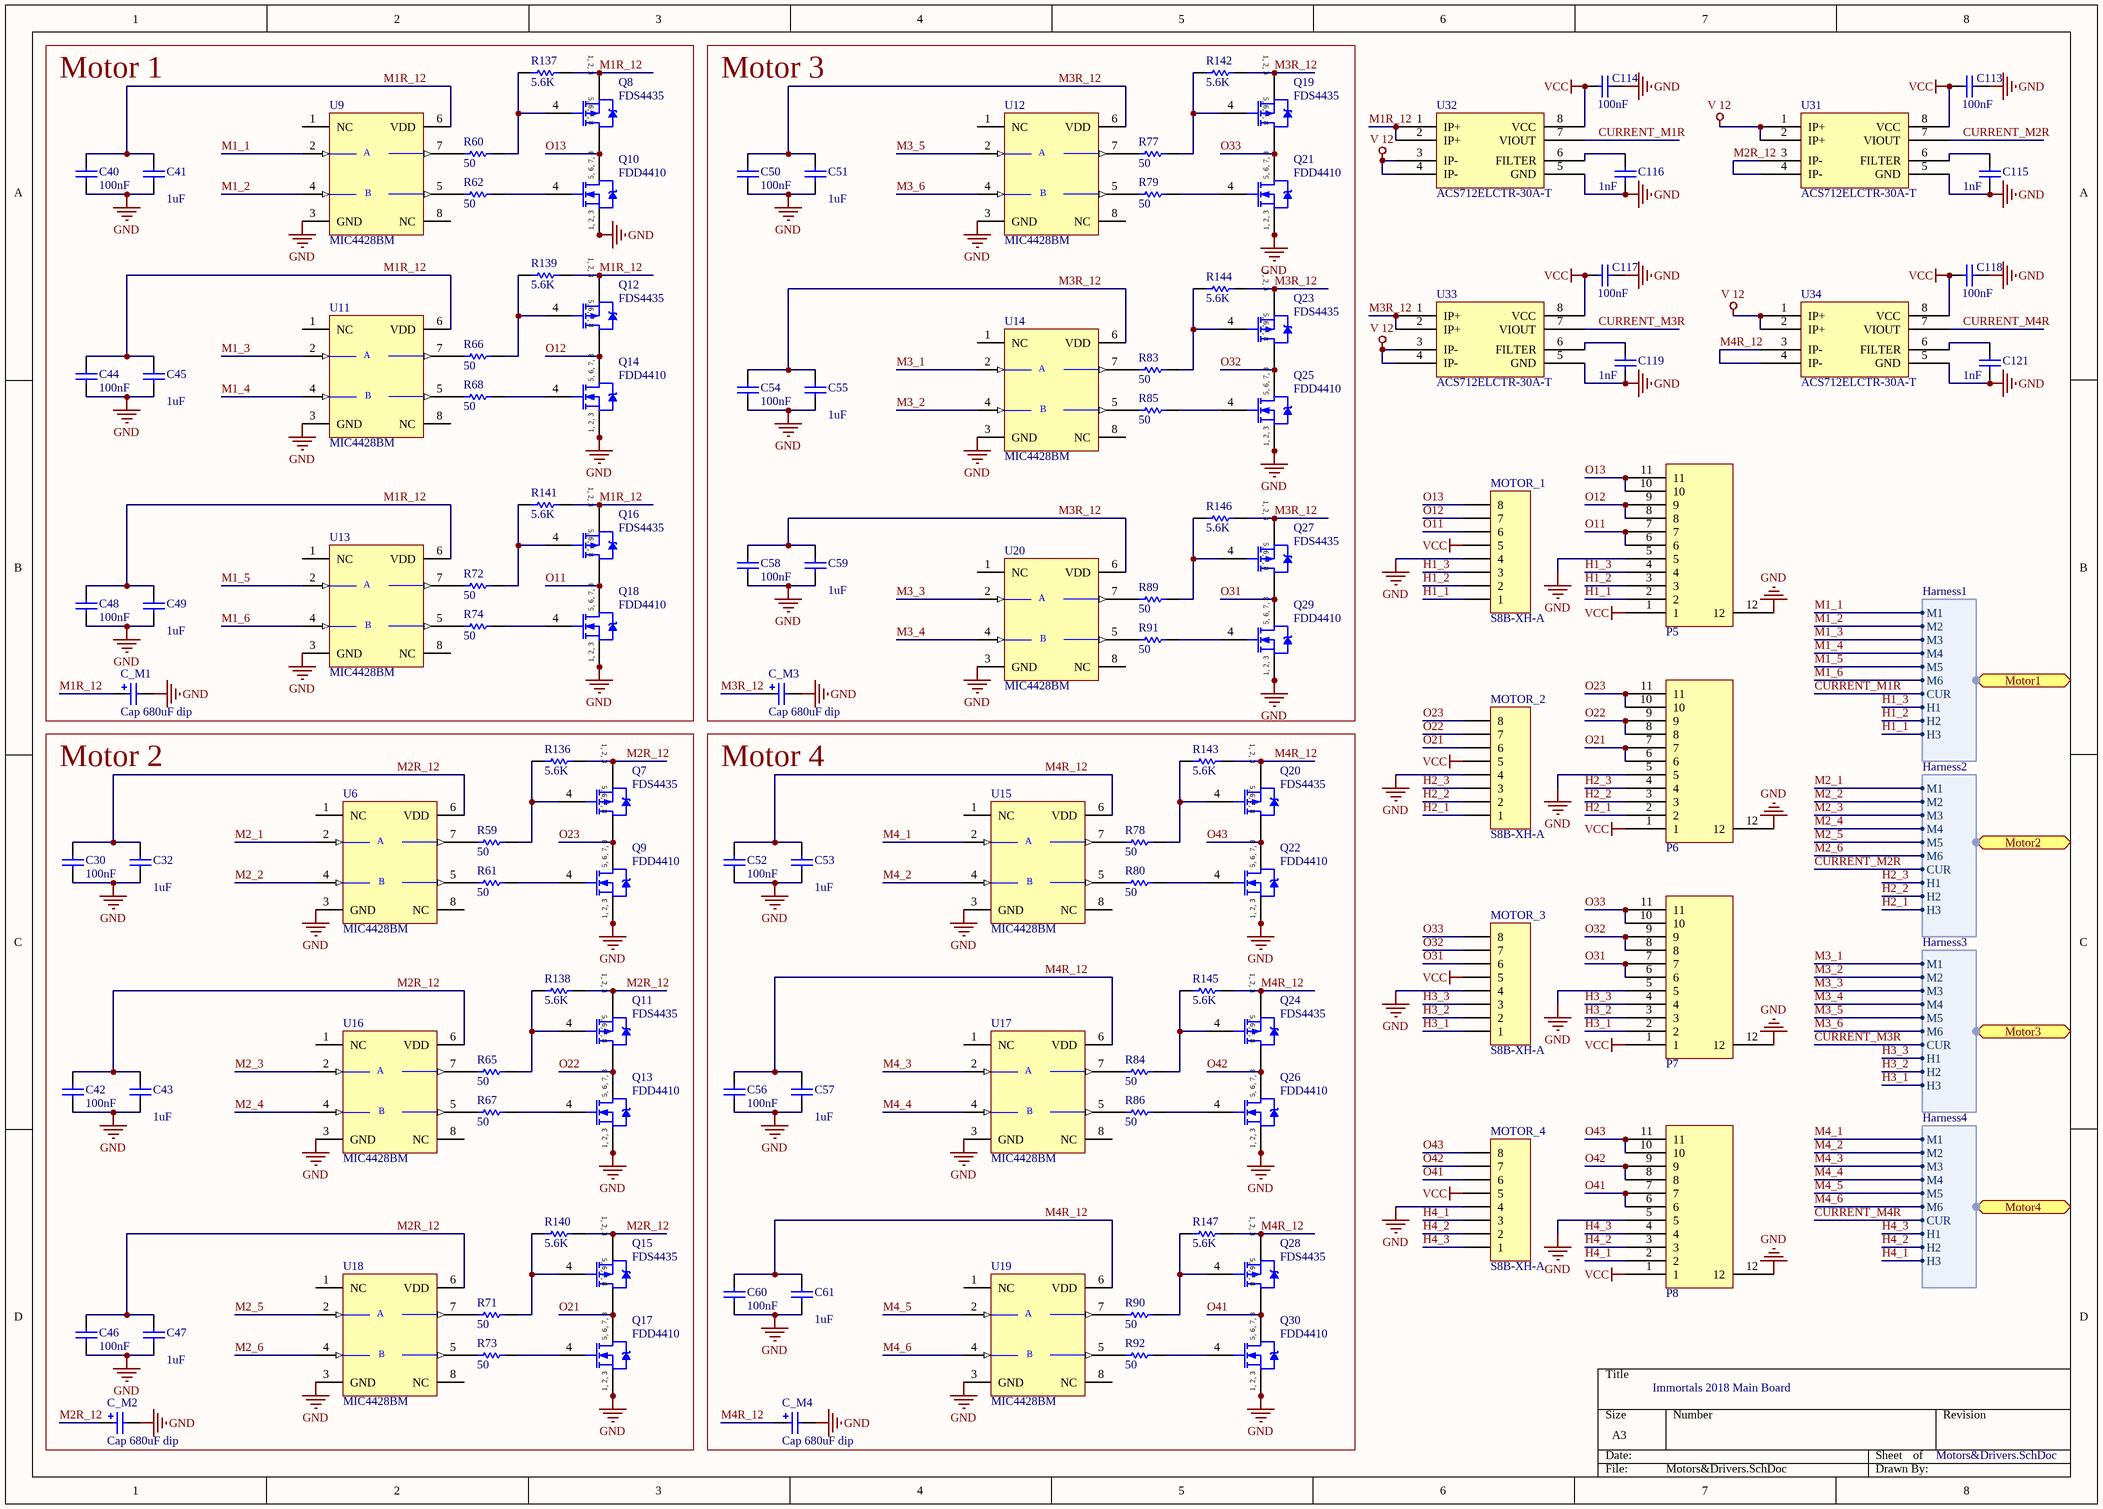
[diagram p2: Motors&Drivers.SchDoc]

### Parts
C30  value 100nF  [1608[0603]]  (hidden comment: Cap 100nF 0603)
C32  value 1uF  [1608[0603]]  (hidden comment: Cap 1uF 0603)
C40  value 100nF  [1608[0603]]  (hidden comment: Cap 100nF 0603)
C41  value 1uF  [1608[0603]]  (hidden comment: Cap 1uF 0603)
C42  value 100nF  [1608[0603]]  (hidden comment: Cap 100nF 0603)
C43  value 1uF  [1608[0603]]  (hidden comment: Cap 1uF 0603)
C44  value 100nF  [1608[0603]]  (hidden comment: Cap 100nF 0603)
C45  value 1uF  [1608[0603]]  (hidden comment: Cap 1uF 0603)
C46  value 100nF  [1608[0603]]  (hidden comment: Cap 100nF 0603)
C47  value 1uF  [1608[0603]]  (hidden comment: Cap 1uF 0603)
C48  value 100nF  [1608[0603]]  (hidden comment: Cap 100nF 0603)
C49  value 1uF  [1608[0603]]  (hidden comment: Cap 1uF 0603)
C50  value 100nF  [1608[0603]]  (hidden comment: Cap 100nF 0603)
C51  value 1uF  [1608[0603]]  (hidden comment: Cap 1uF 0603)
C52  value 100nF  [1608[0603]]  (hidden comment: Cap 100nF 0603)
C53  value 1uF  [1608[0603]]  (hidden comment: Cap 1uF 0603)
C54  value 100nF  [1608[0603]]  (hidden comment: Cap 100nF 0603)
C55  value 1uF  [1608[0603]]  (hidden comment: Cap 1uF 0603)
C56  value 100nF  [1608[0603]]  (hidden comment: Cap 100nF 0603)
C57  value 1uF  [1608[0603]]  (hidden comment: Cap 1uF 0603)
C58  value 100nF  [1608[0603]]  (hidden comment: Cap 100nF 0603)
C59  value 1uF  [1608[0603]]  (hidden comment: Cap 1uF 0603)
C60  value 100nF  [1608[0603]]  (hidden comment: Cap 100nF 0603)
C61  value 1uF  [1608[0603]]  (hidden comment: Cap 1uF 0603)
C113  value 100nF  [1608[0603]]  (hidden comment: Cap 100nF 0603)
C114  value 100nF  [1608[0603]]  (hidden comment: Cap 100nF 0603)
C115  value 1nF  [1608[0603]]  (hidden comment: Cap 1nF 0603)
C116  value 1nF  [1608[0603]]  (hidden comment: Cap 1nF 0603)
C117  value 100nF  [1608[0603]]  (hidden comment: Cap 100nF 0603)
C118  value 100nF  [1608[0603]]  (hidden comment: Cap 100nF 0603)
C119  value 1nF  [1608[0603]]  (hidden comment: Cap 1nF 0603)
C121  value 1nF  [1608[0603]]  (hidden comment: Cap 1nF 0603)
C_M1  Cap 680uF dip  [CAPPR5-5x5]
C_M2  Cap 680uF dip  [CAPPR5-5x5]
C_M3  Cap 680uF dip  [CAPPR5-5x5]
C_M4  Cap 680uF dip  [CAPPR5-5x5]
MOTOR_1  S8B-XH-A  [S8B-XH-A-1]
MOTOR_2  S8B-XH-A  [S8B-XH-A-1]
MOTOR_3  S8B-XH-A  [S8B-XH-A-1]
MOTOR_4  S8B-XH-A  [S8B-XH-A-1]
P5  TYCO  [TYCO]  (value not drawn)
P6  TYCO  [TYCO]  (value not drawn)
P7  TYCO  [TYCO]  (value not drawn)
P8  TYCO  [TYCO]  (value not drawn)
Q7  FDS4435  [SO-8_L]
Q8  FDS4435  [SO-8_L]
Q9  FDD4410  [SO-8_L]
Q10  FDD4410  [SO-8_L]
Q11  FDS4435  [SO-8_L]
Q12  FDS4435  [SO-8_L]
Q13  FDD4410  [SO-8_L]
Q14  FDD4410  [SO-8_L]
Q15  FDS4435  [SO-8_L]
Q16  FDS4435  [SO-8_L]
Q17  FDD4410  [SO-8_L]
Q18  FDD4410  [SO-8_L]
Q19  FDS4435  [SO-8_L]
Q20  FDS4435  [SO-8_L]
Q21  FDD4410  [SO-8_L]
Q22  FDD4410  [SO-8_L]
Q23  FDS4435  [SO-8_L]
Q24  FDS4435  [SO-8_L]
Q25  FDD4410  [SO-8_L]
Q26  FDD4410  [SO-8_L]
Q27  FDS4435  [SO-8_L]
Q28  FDS4435  [SO-8_L]
Q29  FDD4410  [SO-8_L]
Q30  FDD4410  [SO-8_L]
R59  value 50  [1608[0603]]  (hidden comment: Res 50 0603)
R60  value 50  [1608[0603]]  (hidden comment: Res 50 0603)
R61  value 50  [1608[0603]]  (hidden comment: Res 50 0603)
R62  value 50  [1608[0603]]  (hidden comment: Res 50 0603)
R65  value 50  [1608[0603]]  (hidden comment: Res 50 0603)
R66  value 50  [1608[0603]]  (hidden comment: Res 50 0603)
R67  value 50  [1608[0603]]  (hidden comment: Res 50 0603)
R68  value 50  [1608[0603]]  (hidden comment: Res 50 0603)
R71  value 50  [1608[0603]]  (hidden comment: Res 50 0603)
R72  value 50  [1608[0603]]  (hidden comment: Res 50 0603)
R73  value 50  [1608[0603]]  (hidden comment: Res 50 0603)
R74  value 50  [1608[0603]]  (hidden comment: Res 50 0603)
R77  value 50  [1608[0603]]  (hidden comment: Res 50 0603)
R78  value 50  [1608[0603]]  (hidden comment: Res 50 0603)
R79  value 50  [1608[0603]]  (hidden comment: Res 50 0603)
R80  value 50  [1608[0603]]  (hidden comment: Res 50 0603)
R83  value 50  [1608[0603]]  (hidden comment: Res 50 0603)
R84  value 50  [1608[0603]]  (hidden comment: Res 50 0603)
R85  value 50  [1608[0603]]  (hidden comment: Res 50 0603)
R86  value 50  [1608[0603]]  (hidden comment: Res 50 0603)
R89  value 50  [1608[0603]]  (hidden comment: Res 50 0603)
R90  value 50  [1608[0603]]  (hidden comment: Res 50 0603)
R91  value 50  [1608[0603]]  (hidden comment: Res 50 0603)
R92  value 50  [1608[0603]]  (hidden comment: Res 50 0603)
R136  value 5.6K  [1608[0603]]  (hidden comment: Res 5.6K 0603)
R137  value 5.6K  [1608[0603]]  (hidden comment: Res 5.6K 0603)
R138  value 5.6K  [1608[0603]]  (hidden comment: Res 5.6K 0603)
R139  value 5.6K  [1608[0603]]  (hidden comment: Res 5.6K 0603)
R140  value 5.6K  [1608[0603]]  (hidden comment: Res 5.6K 0603)
R141  value 5.6K  [1608[0603]]  (hidden comment: Res 5.6K 0603)
R142  value 5.6K  [1608[0603]]  (hidden comment: Res 5.6K 0603)
R143  value 5.6K  [1608[0603]]  (hidden comment: Res 5.6K 0603)
R144  value 5.6K  [1608[0603]]  (hidden comment: Res 5.6K 0603)
R145  value 5.6K  [1608[0603]]  (hidden comment: Res 5.6K 0603)
R146  value 5.6K  [1608[0603]]  (hidden comment: Res 5.6K 0603)
R147  value 5.6K  [1608[0603]]  (hidden comment: Res 5.6K 0603)
U6  MIC4428BM  [NSO8_L]
U9  MIC4428BM  [NSO8_L]
U11  MIC4428BM  [NSO8_L]
U12  MIC4428BM  [NSO8_L]
U13  MIC4428BM  [NSO8_L]
U14  MIC4428BM  [NSO8_L]
U15  MIC4428BM  [NSO8_L]
U16  MIC4428BM  [NSO8_L]
U17  MIC4428BM  [NSO8_L]
U18  MIC4428BM  [NSO8_L]
U19  MIC4428BM  [NSO8_L]
U20  MIC4428BM  [NSO8_L]
U31  ACS712ELCTR-30A-T  [SOIC_8]
U32  ACS712ELCTR-30A-T  [SOIC_8]
U33  ACS712ELCTR-30A-T  [SOIC_8]
U34  ACS712ELCTR-30A-T  [SOIC_8]

### Blocks framed on the sheet
Motor 1: C40 C41 C44 C45 C48 C49 C_M1 Q8 Q10 Q12 Q14 Q16 Q18 R60 R62 R66 R68 R72 R74 R137 R139 R141 U9 U11 U13
Motor 3: C50 C51 C54 C55 C58 C59 C_M3 Q19 Q21 Q23 Q25 Q27 Q29 R77 R79 R83 R85 R89 R91 R142 R144 R146 U12 U14 U20
Motor 2: C30 C32 C42 C43 C46 C47 C_M2 Q7 Q9 Q11 Q13 Q15 Q17 R59 R61 R65 R67 R71 R73 R136 R138 R140 U6 U16 U18
Motor 4: C52 C53 C56 C57 C60 C61 C_M4 Q20 Q22 Q24 Q26 Q28 Q30 R78 R80 R84 R86 R90 R92 R143 R145 R147 U15 U17 U19

### Ports
Motor1 (harness Harness1), Motor2 (harness Harness2), Motor3 (harness Harness3), Motor4 (harness Harness4)

### Harnesses
Harness1: M1, M2, M3, M4, M5, M6, CUR, H1, H2, H3
Harness2: M1, M2, M3, M4, M5, M6, CUR, H1, H2, H3
Harness3: M1, M2, M3, M4, M5, M6, CUR, H1, H2, H3
Harness4: M1, M2, M3, M4, M5, M6, CUR, H1, H2, H3

### Nets
GND: C30.1 C32.1 C40.1 C41.1 C42.1 C43.1 C44.1 C45.1 C46.1 C47.1 C48.1 C49.1 C50.1 C51.1 C52.1 C53.1 C54.1 C55.1 C56.1 C57.1 C58.1 C59.1 C60.1 C61.1 C113.2 C114.2 C115.2 C116.2 C117.2 C118.2 C119.2 C121.2 C_M1.2 C_M2.2 C_M3.2 C_M4.2 MOTOR_1.4 MOTOR_2.4 MOTOR_3.4 MOTOR_4.4 P5.5 P5.12 P6.5 P6.12 P7.5 P7.12 P8.5 P8.12 Q9.1(S) Q9.2(S) Q9.3(S) Q10.1(S) Q10.2(S) Q10.3(S) Q13.1(S) Q13.2(S) Q13.3(S) Q14.1(S) Q14.2(S) Q14.3(S) Q17.1(S) Q17.2(S) Q17.3(S) Q18.1(S) Q18.2(S) Q18.3(S) Q21.1(S) Q21.2(S) Q21.3(S) Q22.1(S) Q22.2(S) Q22.3(S) Q25.1(S) Q25.2(S) Q25.3(S) Q26.1(S) Q26.2(S) Q26.3(S) Q29.1(S) Q29.2(S) Q29.3(S) Q30.1(S) Q30.2(S) Q30.3(S) U6.3(GND) U9.3(GND) U11.3(GND) U12.3(GND) U13.3(GND) U14.3(GND) U15.3(GND) U16.3(GND) U17.3(GND) U18.3(GND) U19.3(GND) U20.3(GND) U31.5(GND) U32.5(GND) U33.5(GND) U34.5(GND)
V 12: U31.1(IP+) U31.2(IP+) U32.3(IP-) U32.4(IP-) U33.3(IP-) U33.4(IP-) U34.1(IP+) U34.2(IP+)
VCC: C113.1 C114.1 C117.1 C118.1 MOTOR_1.5 MOTOR_2.5 MOTOR_3.5 MOTOR_4.5 P5.1 P6.1 P7.1 P8.1 U31.8(VCC) U32.8(VCC) U33.8(VCC) U34.8(VCC)
CURRENT_M1R: U32.7(VIOUT) ; port Motor1.CUR  [project net CUR_M1]
CURRENT_M2R: U31.7(VIOUT) ; port Motor2.CUR  [project net CUR_M2]
CURRENT_M3R: U33.7(VIOUT) ; port Motor3.CUR  [project net CUR_M3]
CURRENT_M4R: U34.7(VIOUT) ; port Motor4.CUR  [project net CUR_M4]
H1_1: MOTOR_1.1 P5.2 ; port Motor1.H3
H1_2: MOTOR_1.2 P5.3 ; port Motor1.H2
H1_3: MOTOR_1.3 P5.4 ; port Motor1.H1
H2_1: MOTOR_2.1 P6.2 ; port Motor2.H3
H2_2: MOTOR_2.2 P6.3 ; port Motor2.H2
H2_3: MOTOR_2.3 P6.4 ; port Motor2.H1
H3_1: MOTOR_3.1 P7.2 ; port Motor3.H3
H3_2: MOTOR_3.2 P7.3 ; port Motor3.H2
H3_3: MOTOR_3.3 P7.4 ; port Motor3.H1
H4_1: MOTOR_4.3 P8.2 ; port Motor4.H3
H4_2: MOTOR_4.2 P8.3 ; port Motor4.H2
H4_3: MOTOR_4.1 P8.4 ; port Motor4.H1
M1_1: U9.2(INA) ; port Motor1.M1
M1_2: U9.4(INB) ; port Motor1.M2
M1_3: U11.2(INA) ; port Motor1.M3
M1_4: U11.4(INB) ; port Motor1.M4
M1_5: U13.2(INA) ; port Motor1.M5
M1_6: U13.4(INB) ; port Motor1.M6
M1R_12: C40.2 C41.2 C44.2 C45.2 C48.2 C49.2 C_M1.1 Q8.1(S) Q8.2(S) Q8.3(S) Q12.1(S) Q12.2(S) Q12.3(S) Q16.1(S) Q16.2(S) Q16.3(S) R137.1 R139.1 R141.1 U9.6(VDD) U11.6(VDD) U13.6(VDD) U32.1(IP+) U32.2(IP+)
M2_1: U6.2(INA) ; port Motor2.M1
M2_2: U6.4(INB) ; port Motor2.M2
M2_3: U16.2(INA) ; port Motor2.M3
M2_4: U16.4(INB) ; port Motor2.M4
M2_5: U18.2(INA) ; port Motor2.M5
M2_6: U18.4(INB) ; port Motor2.M6
M2R_12: C30.2 C32.2 C42.2 C43.2 C46.2 C47.2 C_M2.1 Q7.1(S) Q7.2(S) Q7.3(S) Q11.1(S) Q11.2(S) Q11.3(S) Q15.1(S) Q15.2(S) Q15.3(S) R136.1 R138.1 R140.1 U6.6(VDD) U16.6(VDD) U18.6(VDD) U31.3(IP-) U31.4(IP-)
M3_1: U14.2(INA) ; port Motor3.M1
M3_2: U14.4(INB) ; port Motor3.M2
M3_3: U20.2(INA) ; port Motor3.M3
M3_4: U20.4(INB) ; port Motor3.M4
M3_5: U12.2(INA) ; port Motor3.M5
M3_6: U12.4(INB) ; port Motor3.M6
M3R_12: C50.2 C51.2 C54.2 C55.2 C58.2 C59.2 C_M3.1 Q19.1(S) Q19.2(S) Q19.3(S) Q23.1(S) Q23.2(S) Q23.3(S) Q27.1(S) Q27.2(S) Q27.3(S) R142.1 R144.1 R146.1 U12.6(VDD) U14.6(VDD) U20.6(VDD) U33.1(IP+) U33.2(IP+)
M4_1: U15.2(INA) ; port Motor4.M1
M4_2: U15.4(INB) ; port Motor4.M2
M4_3: U17.2(INA) ; port Motor4.M3
M4_4: U17.4(INB) ; port Motor4.M4
M4_5: U19.2(INA) ; port Motor4.M5
M4_6: U19.4(INB) ; port Motor4.M6
M4R_12: C52.2 C53.2 C56.2 C57.2 C60.2 C61.2 C_M4.1 Q20.1(S) Q20.2(S) Q20.3(S) Q24.1(S) Q24.2(S) Q24.3(S) Q28.1(S) Q28.2(S) Q28.3(S) R143.1 R145.1 R147.1 U15.6(VDD) U17.6(VDD) U19.6(VDD) U34.3(IP-) U34.4(IP-)
O11: MOTOR_1.6 P5.6 P5.7 Q16.5(D) Q16.6(D) Q16.7(D) Q16.8(D) Q18.5(D) Q18.6(D) Q18.7(D) Q18.8(D)
O12: MOTOR_1.7 P5.8 P5.9 Q12.5(D) Q12.6(D) Q12.7(D) Q12.8(D) Q14.5(D) Q14.6(D) Q14.7(D) Q14.8(D)
O13: MOTOR_1.8 P5.10 P5.11 Q8.5(D) Q8.6(D) Q8.7(D) Q8.8(D) Q10.5(D) Q10.6(D) Q10.7(D) Q10.8(D)
O21: MOTOR_2.6 P6.6 P6.7 Q15.5(D) Q15.6(D) Q15.7(D) Q15.8(D) Q17.5(D) Q17.6(D) Q17.7(D) Q17.8(D)
O22: MOTOR_2.7 P6.8 P6.9 Q11.5(D) Q11.6(D) Q11.7(D) Q11.8(D) Q13.5(D) Q13.6(D) Q13.7(D) Q13.8(D)
O23: MOTOR_2.8 P6.10 P6.11 Q7.5(D) Q7.6(D) Q7.7(D) Q7.8(D) Q9.5(D) Q9.6(D) Q9.7(D) Q9.8(D)
O31: MOTOR_3.6 P7.6 P7.7 Q27.5(D) Q27.6(D) Q27.7(D) Q27.8(D) Q29.5(D) Q29.6(D) Q29.7(D) Q29.8(D)
O32: MOTOR_3.7 P7.8 P7.9 Q23.5(D) Q23.6(D) Q23.7(D) Q23.8(D) Q25.5(D) Q25.6(D) Q25.7(D) Q25.8(D)
O33: MOTOR_3.8 P7.10 P7.11 Q19.5(D) Q19.6(D) Q19.7(D) Q19.8(D) Q21.5(D) Q21.6(D) Q21.7(D) Q21.8(D)
O41: MOTOR_4.6 P8.6 P8.7 Q28.5(D) Q28.6(D) Q28.7(D) Q28.8(D) Q30.5(D) Q30.6(D) Q30.7(D) Q30.8(D)
O42: MOTOR_4.7 P8.8 P8.9 Q24.5(D) Q24.6(D) Q24.7(D) Q24.8(D) Q26.5(D) Q26.6(D) Q26.7(D) Q26.8(D)
O43: MOTOR_4.8 P8.10 P8.11 Q20.5(D) Q20.6(D) Q20.7(D) Q20.8(D) Q22.5(D) Q22.6(D) Q22.7(D) Q22.8(D)
NetC115_1: C115.1 U31.6(FILTER)
NetC116_1: C116.1 U32.6(FILTER)
NetC119_1: C119.1 U33.6(FILTER)
NetC121_1: C121.1 U34.6(FILTER)
NetQ7_4: Q7.4(G) R59.2 R136.2
NetQ8_4: Q8.4(G) R60.2 R137.2
NetQ9_4: Q9.4(G) R61.2
NetQ10_4: Q10.4(G) R62.2
NetQ11_4: Q11.4(G) R65.2 R138.2
NetQ12_4: Q12.4(G) R66.2 R139.2
NetQ13_4: Q13.4(G) R67.2
NetQ14_4: Q14.4(G) R68.2
NetQ15_4: Q15.4(G) R71.2 R140.2
NetQ16_4: Q16.4(G) R72.2 R141.2
NetQ17_4: Q17.4(G) R73.2
NetQ18_4: Q18.4(G) R74.2
NetQ19_4: Q19.4(G) R77.2 R142.2
NetQ20_4: Q20.4(G) R78.2 R143.2
NetQ21_4: Q21.4(G) R79.2
NetQ22_4: Q22.4(G) R80.2
NetQ23_4: Q23.4(G) R83.2 R144.2
NetQ24_4: Q24.4(G) R84.2 R145.2
NetQ25_4: Q25.4(G) R85.2
NetQ26_4: Q26.4(G) R86.2
NetQ27_4: Q27.4(G) R89.2 R146.2
NetQ28_4: Q28.4(G) R90.2 R147.2
NetQ29_4: Q29.4(G) R91.2
NetQ30_4: Q30.4(G) R92.2
NetR59_1: R59.1 U6.7(OUTA)
NetR60_1: R60.1 U9.7(OUTA)
NetR61_1: R61.1 U6.5(OUTB)
NetR62_1: R62.1 U9.5(OUTB)
NetR65_1: R65.1 U16.7(OUTA)
NetR66_1: R66.1 U11.7(OUTA)
NetR67_1: R67.1 U16.5(OUTB)
NetR68_1: R68.1 U11.5(OUTB)
NetR71_1: R71.1 U18.7(OUTA)
NetR72_1: R72.1 U13.7(OUTA)
NetR73_1: R73.1 U18.5(OUTB)
NetR74_1: R74.1 U13.5(OUTB)
NetR77_1: R77.1 U12.7(OUTA)
NetR78_1: R78.1 U15.7(OUTA)
NetR79_1: R79.1 U12.5(OUTB)
NetR80_1: R80.1 U15.5(OUTB)
NetR83_1: R83.1 U14.7(OUTA)
NetR84_1: R84.1 U17.7(OUTA)
NetR85_1: R85.1 U14.5(OUTB)
NetR86_1: R86.1 U17.5(OUTB)
NetR89_1: R89.1 U20.7(OUTA)
NetR90_1: R90.1 U19.7(OUTA)
NetR91_1: R91.1 U20.5(OUTB)
NetR92_1: R92.1 U19.5(OUTB)

Not connected (* = marked no-connect by the designer): U6 1(NC) 8(NC); U9 1(NC) 8(NC); U11 1(NC) 8(NC); U12 1(NC) 8(NC); U13 1(NC) 8(NC); U14 1(NC) 8(NC); U15 1(NC) 8(NC); U16 1(NC) 8(NC); U17 1(NC) 8(NC); U18 1(NC) 8(NC); U19 1(NC) 8(NC); U20 1(NC) 8(NC)

### Notes on the sheet
- Immortals 2018 Main Board
- (in symbol IRF7201) 5, 6, 7, 8; 1, 2, 3
- (in symbol IRF7204) 1, 2, 3; 5, 6, 7, 8
- (in symbol MAX4427CSA) A; B

### Library data of the parts
C30 C32 C40-C61 C113-C119 C121 = Cap Semi: Capacitor (Semiconductor SIM Model); Published: 8-Jun-2000; LatestRevisionDate: 17-Jul-2002; LatestRevisionNote: Re-released for DXP Platform.; PackageReference: C1206; Publisher: Altium Limited
C_M1-C_M4 = Cap Pol1: Polarized Capacitor (Radial); Published: 8-Jun-2000; LatestRevisionDate: 17-Jul-2002; LatestRevisionNote: Re-released for DXP Platform.; PackageReference: RB7.6-15; Publisher: Altium Limited; Value: 680uF
MOTOR_1-MOTOR_4 = 8pin XH: Value: S8B-XH-A
P5-P8 = TYCO: 11-pin Bottom Contact 30W Motor connector; Value: Bottom Contact
Q7 Q8 Q11 Q12 Q15 Q16 Q19 Q20 Q23 Q24 Q27 Q28 = IRF7204: HEXFET Power MOSFET; Published: 8-Jun-2000; LatestRevisionDate: 13-Apr-2006; LatestRevisionNote: IPC-7351 Footprint Added.; DatasheetVersion: Aug-1997; PackageVersion: Feb-2001; PackageReference: SO-8; Publisher: Altium Limited; PackageDescription: 8-Pin Plastic Small Outline Integrated Circuit 1.27 mm Pitch; Code_JEDEC: MS-012-AA; Code_IPC: SOIC127P600-8; ComponentLink1Description: Manufacturer Link; ComponentLink1URL: http://www.irf.com/; ComponentLink2Description: Datasheet; ComponentLink2URL: http://www.irf.com/product-info/datasheets/data/irf7204.pdf
Q9 Q10 Q13 Q14 Q17 Q18 Q21 Q22 Q25 Q26 Q29 Q30 = IRF7201: HEXFET Power MOSFET; Published: 8-Jun-2000; LatestRevisionDate: 13-Apr-2006; LatestRevisionNote: IPC-7351 Footprint Added.; DatasheetVersion: Sep-1998; PackageVersion: Feb-2001; PackageReference: SO-8; Publisher: Altium Limited; PackageDescription: 8-Pin Plastic Small Outline Integrated Circuit 1.27 mm Pitch; Code_JEDEC: MS-012-AA; Code_IPC: SOIC127P600-8; ComponentLink1Description: Manufacturer Link; ComponentLink1URL: http://www.irf.com/; ComponentLink2Description: Datasheet; ComponentLink2URL: http://www.irf.com/product-info/datasheets/data/irf7201.pdf
R59-R62 R65-R68 R71-R74 R77-R80 R83-R86 R89-R92 R136-R147 = Res Semi: Semiconductor Resistor; Published: 8-Jun-2000; LatestRevisionDate: 17-Jul-2002; LatestRevisionNote: Re-released for DXP Platform.; PackageReference: AXIAL-0.5; Publisher: Altium Limited
U6 U9 U11-U20 = MAX4427CSA: Dual High-Speed 1.5A MOSFET Driver; Published: 16-Jan-2001; LatestRevisionDate: 13-Apr-2006; LatestRevisionNote: IPC-7351 Footprint Added.; DatasheetVersion: Mar-1993; PackageReference: NSO8; Publisher: Altium Limited; PackageDescription: 8-Pin Small Outline Integrated Circuit 1.27 mm Pitch; Code_JEDEC: MS-012-AA; Code_IPC: SOIC127P600-8; ComponentLink1Description: Manufacturer Link; ComponentLink1URL: http://www.maxim-ic.com/; ComponentLink2Description: Datasheet; ComponentLink2URL: http://pdfserv.maxim-ic.com/en/ds/MAX4426-MAX4428.pdf

## Sheet Dribbler.SchDoc
size A4
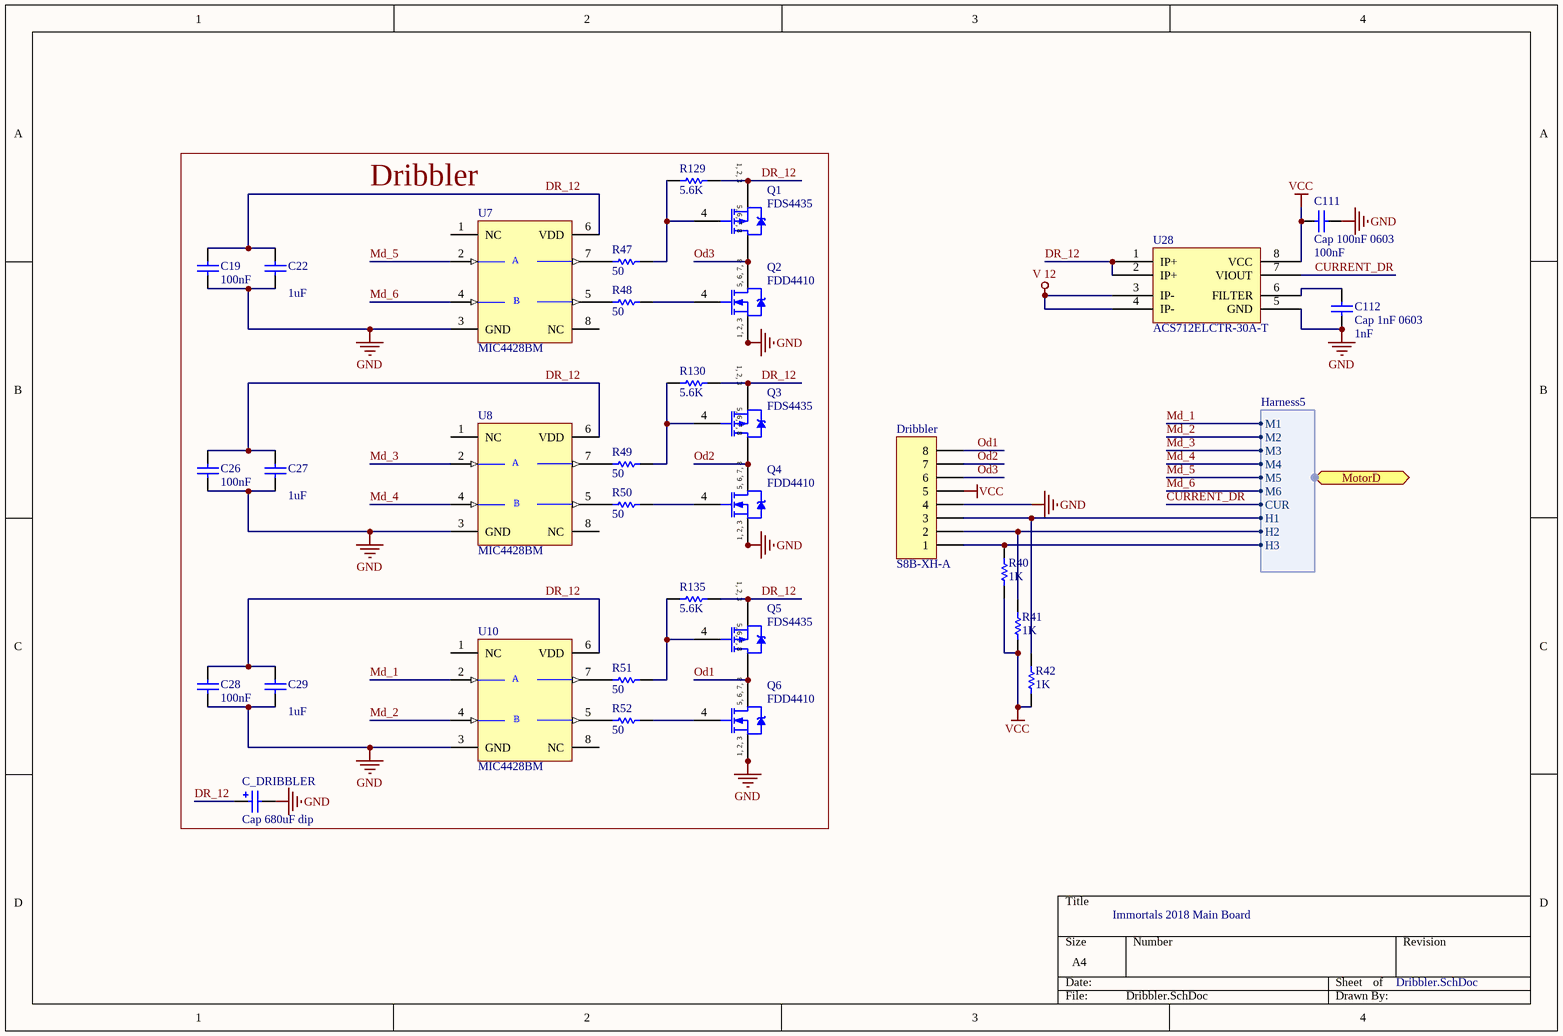
[diagram p3: Dribbler.SchDoc]

### Parts
C19  value 100nF  [1608[0603]]  (hidden comment: Cap 100nF 0603)
C22  value 1uF  [1608[0603]]  (hidden comment: Cap 1uF 0603)
C26  value 100nF  [1608[0603]]  (hidden comment: Cap 100nF 0603)
C27  value 1uF  [1608[0603]]  (hidden comment: Cap 1uF 0603)
C28  value 100nF  [1608[0603]]  (hidden comment: Cap 100nF 0603)
C29  value 1uF  [1608[0603]]  (hidden comment: Cap 1uF 0603)
C111  Cap 100nF 0603  value 100nF  [1608[0603]]
C112  Cap 1nF 0603  value 1nF  [1608[0603]]
C_DRIBBLER  Cap 680uF dip  [CAPPR5-5x5]
Dribbler  S8B-XH-A  [S8B-XH-A-1]
Q1  FDS4435  [SO-8_L]
Q2  FDD4410  [SO-8_L]
Q3  FDS4435  [SO-8_L]
Q4  FDD4410  [SO-8_L]
Q5  FDS4435  [SO-8_L]
Q6  FDD4410  [SO-8_L]
R40  value 1K  [1608[0603]]  (hidden comment: Res 1K 0603)
R41  value 1K  [1608[0603]]  (hidden comment: Res 1K 0603)
R42  value 1K  [1608[0603]]  (hidden comment: Res 1K 0603)
R47  value 50  [1608[0603]]  (hidden comment: Res 50 0603)
R48  value 50  [1608[0603]]  (hidden comment: Res 50 0603)
R49  value 50  [1608[0603]]  (hidden comment: Res 50 0603)
R50  value 50  [1608[0603]]  (hidden comment: Res 50 0603)
R51  value 50  [1608[0603]]  (hidden comment: Res 50 0603)
R52  value 50  [1608[0603]]  (hidden comment: Res 50 0603)
R129  value 5.6K  [1608[0603]]  (hidden comment: Res 5.6K 0603)
R130  value 5.6K  [1608[0603]]  (hidden comment: Res 5.6K 0603)
R135  value 5.6K  [1608[0603]]  (hidden comment: Res 5.6K 0603)
U7  MIC4428BM  [NSO8_L]
U8  MIC4428BM  [NSO8_L]
U10  MIC4428BM  [NSO8_L]
U28  ACS712ELCTR-30A-T  [SOIC_8]

### Blocks framed on the sheet
Dribbler: C19 C22 C26-C29 C_DRIBBLER Q1-Q6 R47-R52 R129 R130 R135 U7 U8 U10

### Ports
MotorD (harness Harness5)

### Harnesses
Harness5: M1, M2, M3, M4, M5, M6, CUR, H1, H2, H3

### Nets
GND: C19.1 C22.1 C26.1 C27.1 C28.1 C29.1 C111.2 C112.2 C_DRIBBLER.2 Dribbler.4 Q2.1(S) Q2.2(S) Q2.3(S) Q4.1(S) Q4.2(S) Q4.3(S) Q6.1(S) Q6.2(S) Q6.3(S) U7.3(GND) U8.3(GND) U10.3(GND) U28.5(GND)
V 12: U28.3(IP-) U28.4(IP-)
VCC: C111.1 Dribbler.5 R40.1 R41.1 R42.1 U28.8(VCC)
CURRENT_DR: U28.7(VIOUT) ; port MotorD.CUR  [project net CUR_MD]
DR_12: C19.2 C22.2 C26.2 C27.2 C28.2 C29.2 C_DRIBBLER.1 Q1.1(S) Q1.2(S) Q1.3(S) Q3.1(S) Q3.2(S) Q3.3(S) Q5.1(S) Q5.2(S) Q5.3(S) R129.1 R130.1 R135.1 U7.6(VDD) U8.6(VDD) U10.6(VDD) U28.1(IP+) U28.2(IP+)
Hd_1: Dribbler.1 R40.2 ; port MotorD.H3
Hd_2: Dribbler.2 R41.2 ; port MotorD.H2
Hd_3: Dribbler.3 R42.2 ; port MotorD.H1
Md_1: U10.2(INA) ; port MotorD.M1
Md_2: U10.4(INB) ; port MotorD.M2
Md_3: U8.2(INA) ; port MotorD.M3
Md_4: U8.4(INB) ; port MotorD.M4
Md_5: U7.2(INA) ; port MotorD.M5
Md_6: U7.4(INB) ; port MotorD.M6
Od1: Dribbler.8 Q5.5(D) Q5.6(D) Q5.7(D) Q5.8(D) Q6.5(D) Q6.6(D) Q6.7(D) Q6.8(D)
Od2: Dribbler.7 Q3.5(D) Q3.6(D) Q3.7(D) Q3.8(D) Q4.5(D) Q4.6(D) Q4.7(D) Q4.8(D)
Od3: Dribbler.6 Q1.5(D) Q1.6(D) Q1.7(D) Q1.8(D) Q2.5(D) Q2.6(D) Q2.7(D) Q2.8(D)
NetC112_1: C112.1 U28.6(FILTER)
NetQ1_4: Q1.4(G) R47.2 R129.2
NetQ2_4: Q2.4(G) R48.2
NetQ3_4: Q3.4(G) R49.2 R130.2
NetQ4_4: Q4.4(G) R50.2
NetQ5_4: Q5.4(G) R51.2 R135.2
NetQ6_4: Q6.4(G) R52.2
NetR47_1: R47.1 U7.7(OUTA)
NetR48_1: R48.1 U7.5(OUTB)
NetR49_1: R49.1 U8.7(OUTA)
NetR50_1: R50.1 U8.5(OUTB)
NetR51_1: R51.1 U10.7(OUTA)
NetR52_1: R52.1 U10.5(OUTB)

Not connected (* = marked no-connect by the designer): U7 1(NC) 8(NC); U8 1(NC) 8(NC); U10 1(NC) 8(NC)

### Notes on the sheet
- Immortals 2018 Main Board
- (in symbol IRF7201) 5, 6, 7, 8; 1, 2, 3
- (in symbol IRF7204) 1, 2, 3; 5, 6, 7, 8
- (in symbol MAX4427CSA) A; B

### Library data of the parts
C19 C22 C26-C29 C111 C112 = Cap Semi: Capacitor (Semiconductor SIM Model); Published: 8-Jun-2000; LatestRevisionDate: 17-Jul-2002; LatestRevisionNote: Re-released for DXP Platform.; PackageReference: C1206; Publisher: Altium Limited
C_DRIBBLER = Cap Pol1: Polarized Capacitor (Radial); Published: 8-Jun-2000; LatestRevisionDate: 17-Jul-2002; LatestRevisionNote: Re-released for DXP Platform.; PackageReference: RB7.6-15; Publisher: Altium Limited; Value: 680uF
Dribbler = 8pin XH
Q1 Q3 Q5 = IRF7204: HEXFET Power MOSFET; Published: 8-Jun-2000; LatestRevisionDate: 13-Apr-2006; LatestRevisionNote: IPC-7351 Footprint Added.; DatasheetVersion: Aug-1997; PackageVersion: Feb-2001; PackageReference: SO-8; Publisher: Altium Limited; PackageDescription: 8-Pin Plastic Small Outline Integrated Circuit 1.27 mm Pitch; Code_JEDEC: MS-012-AA; Code_IPC: SOIC127P600-8; ComponentLink1Description: Manufacturer Link; ComponentLink1URL: http://www.irf.com/; ComponentLink2Description: Datasheet; ComponentLink2URL: http://www.irf.com/product-info/datasheets/data/irf7204.pdf
Q2 Q4 Q6 = IRF7201: HEXFET Power MOSFET; Published: 8-Jun-2000; LatestRevisionDate: 13-Apr-2006; LatestRevisionNote: IPC-7351 Footprint Added.; DatasheetVersion: Sep-1998; PackageVersion: Feb-2001; PackageReference: SO-8; Publisher: Altium Limited; PackageDescription: 8-Pin Plastic Small Outline Integrated Circuit 1.27 mm Pitch; Code_JEDEC: MS-012-AA; Code_IPC: SOIC127P600-8; ComponentLink1Description: Manufacturer Link; ComponentLink1URL: http://www.irf.com/; ComponentLink2Description: Datasheet; ComponentLink2URL: http://www.irf.com/product-info/datasheets/data/irf7201.pdf
R40-R42 R47-R52 R129 R130 R135 = Res Semi: Semiconductor Resistor; Published: 8-Jun-2000; LatestRevisionDate: 17-Jul-2002; LatestRevisionNote: Re-released for DXP Platform.; PackageReference: AXIAL-0.5; Publisher: Altium Limited
U7 U8 U10 = MAX4427CSA: Dual High-Speed 1.5A MOSFET Driver; Published: 16-Jan-2001; LatestRevisionDate: 13-Apr-2006; LatestRevisionNote: IPC-7351 Footprint Added.; DatasheetVersion: Mar-1993; PackageReference: NSO8; Publisher: Altium Limited; PackageDescription: 8-Pin Small Outline Integrated Circuit 1.27 mm Pitch; Code_JEDEC: MS-012-AA; Code_IPC: SOIC127P600-8; ComponentLink1Description: Manufacturer Link; ComponentLink1URL: http://www.maxim-ic.com/; ComponentLink2Description: Datasheet; ComponentLink2URL: http://pdfserv.maxim-ic.com/en/ds/MAX4426-MAX4428.pdf